# EAGLE design Arduino-DUE-SODIMM (EAGLE 6.4)
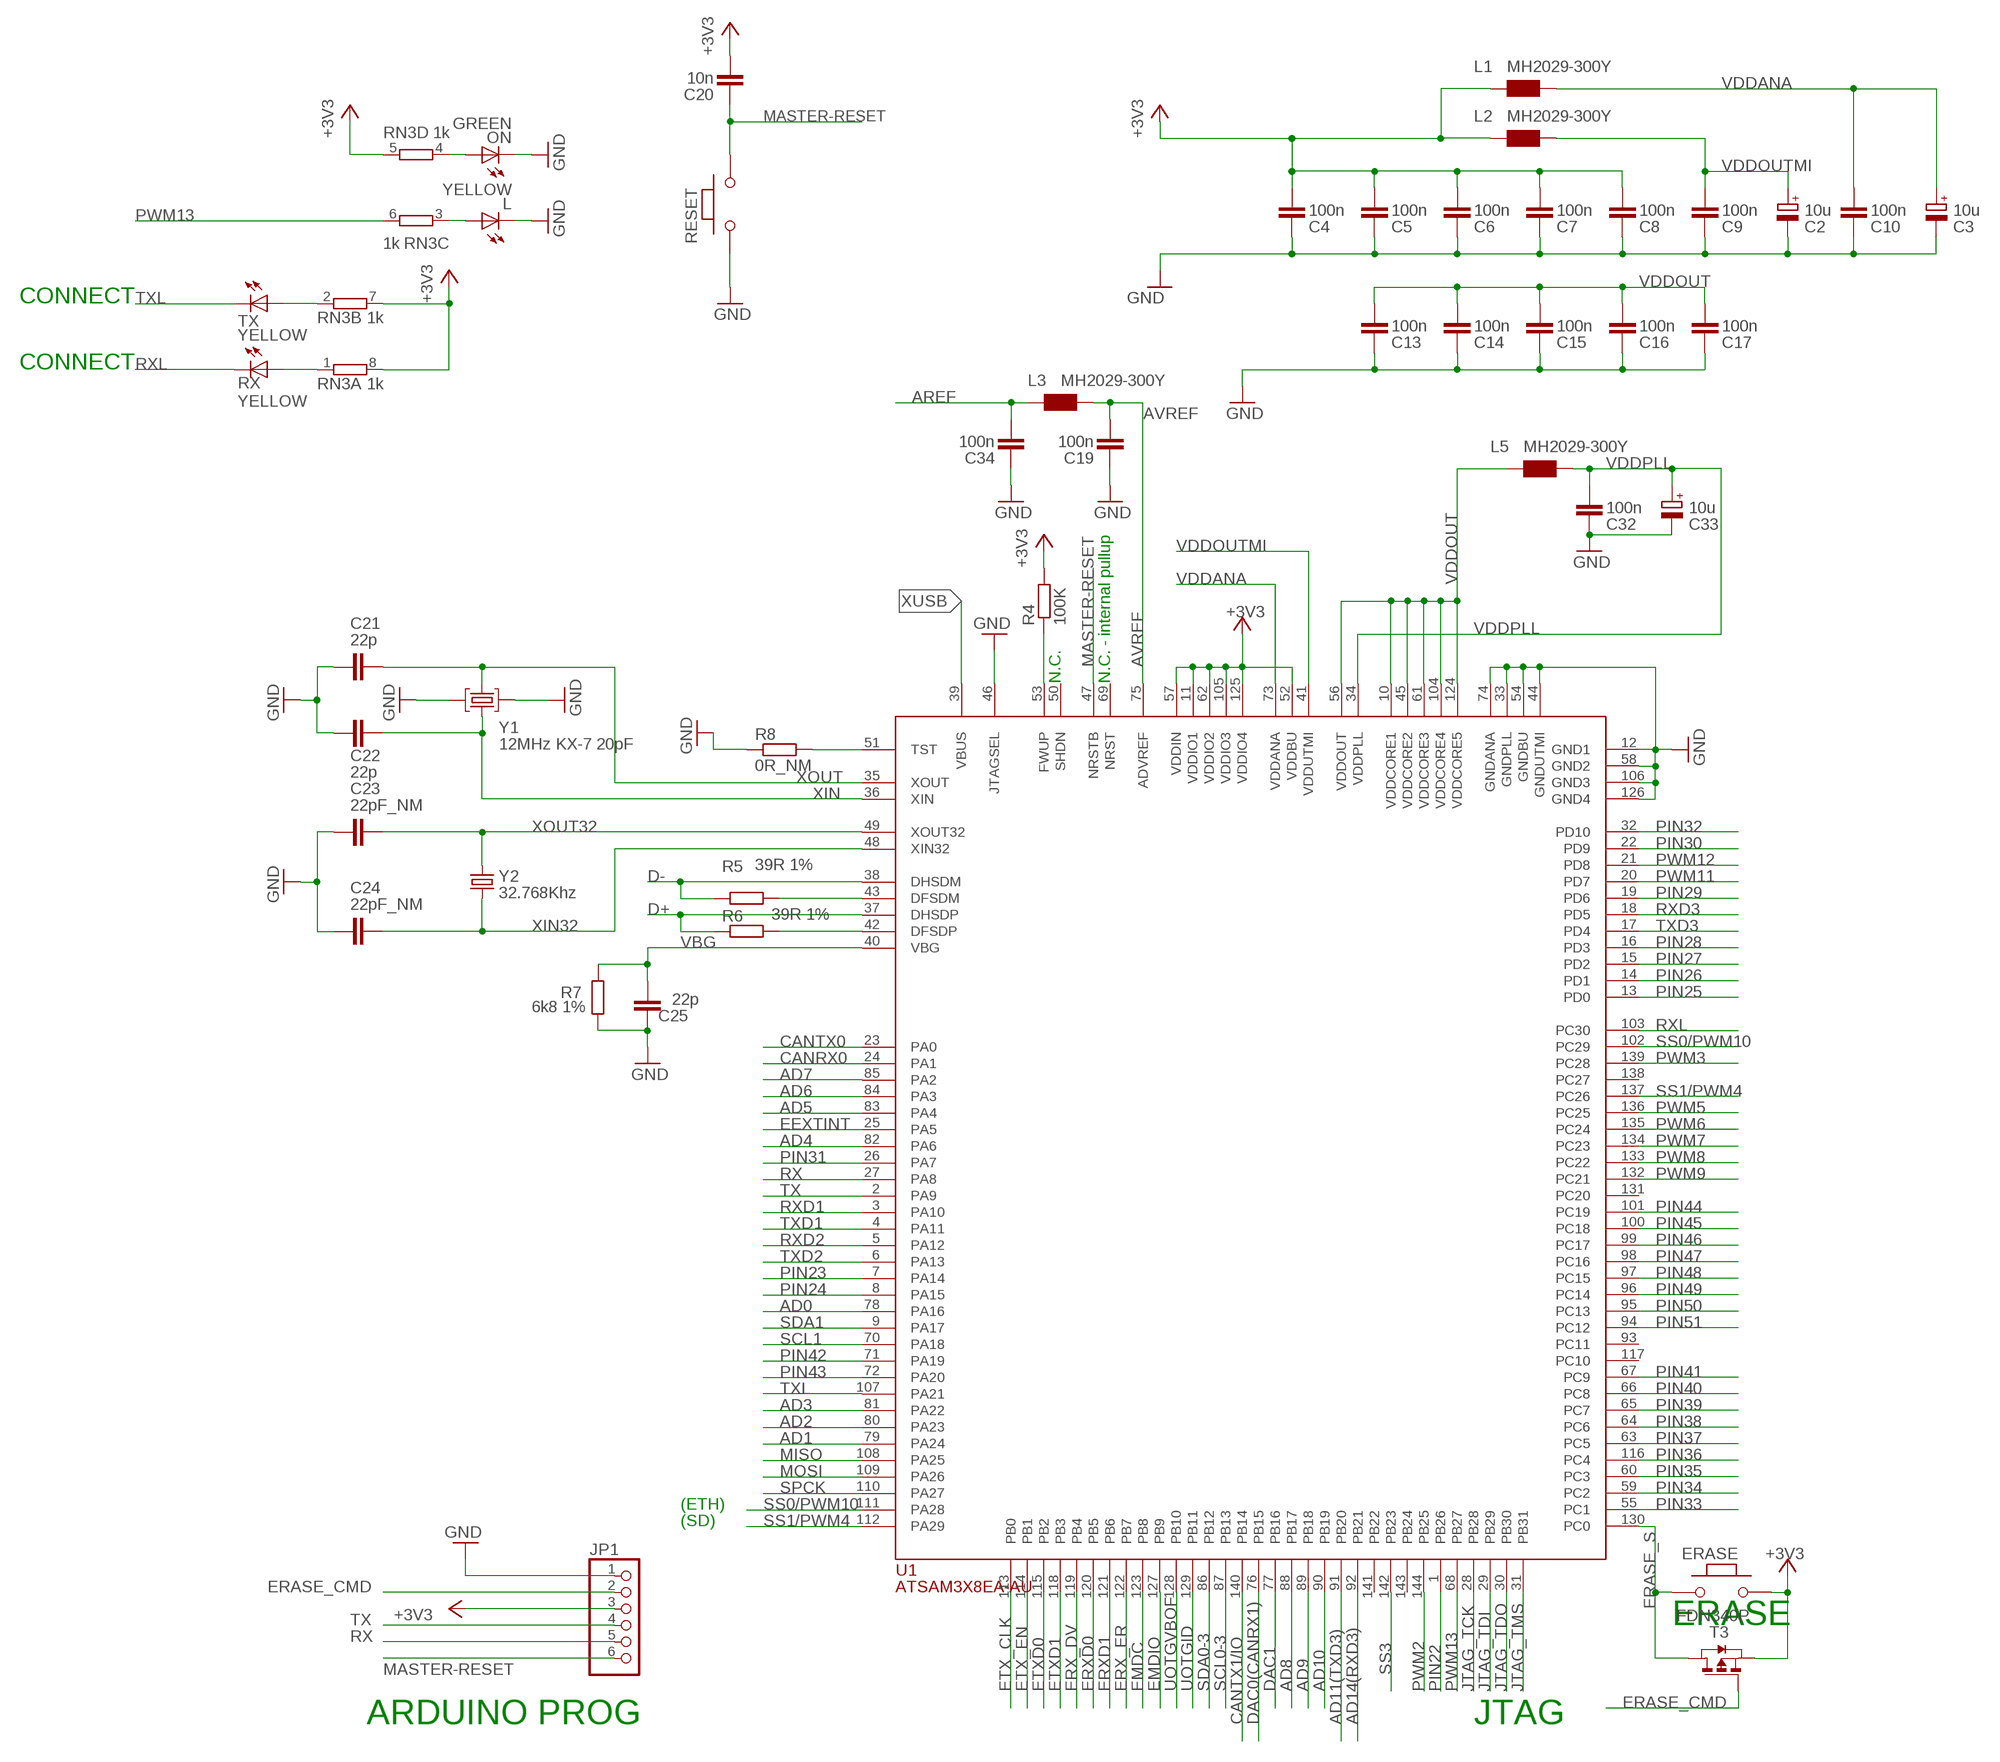
[diagram p0: schematic, sheet 1, part 1 of 2]
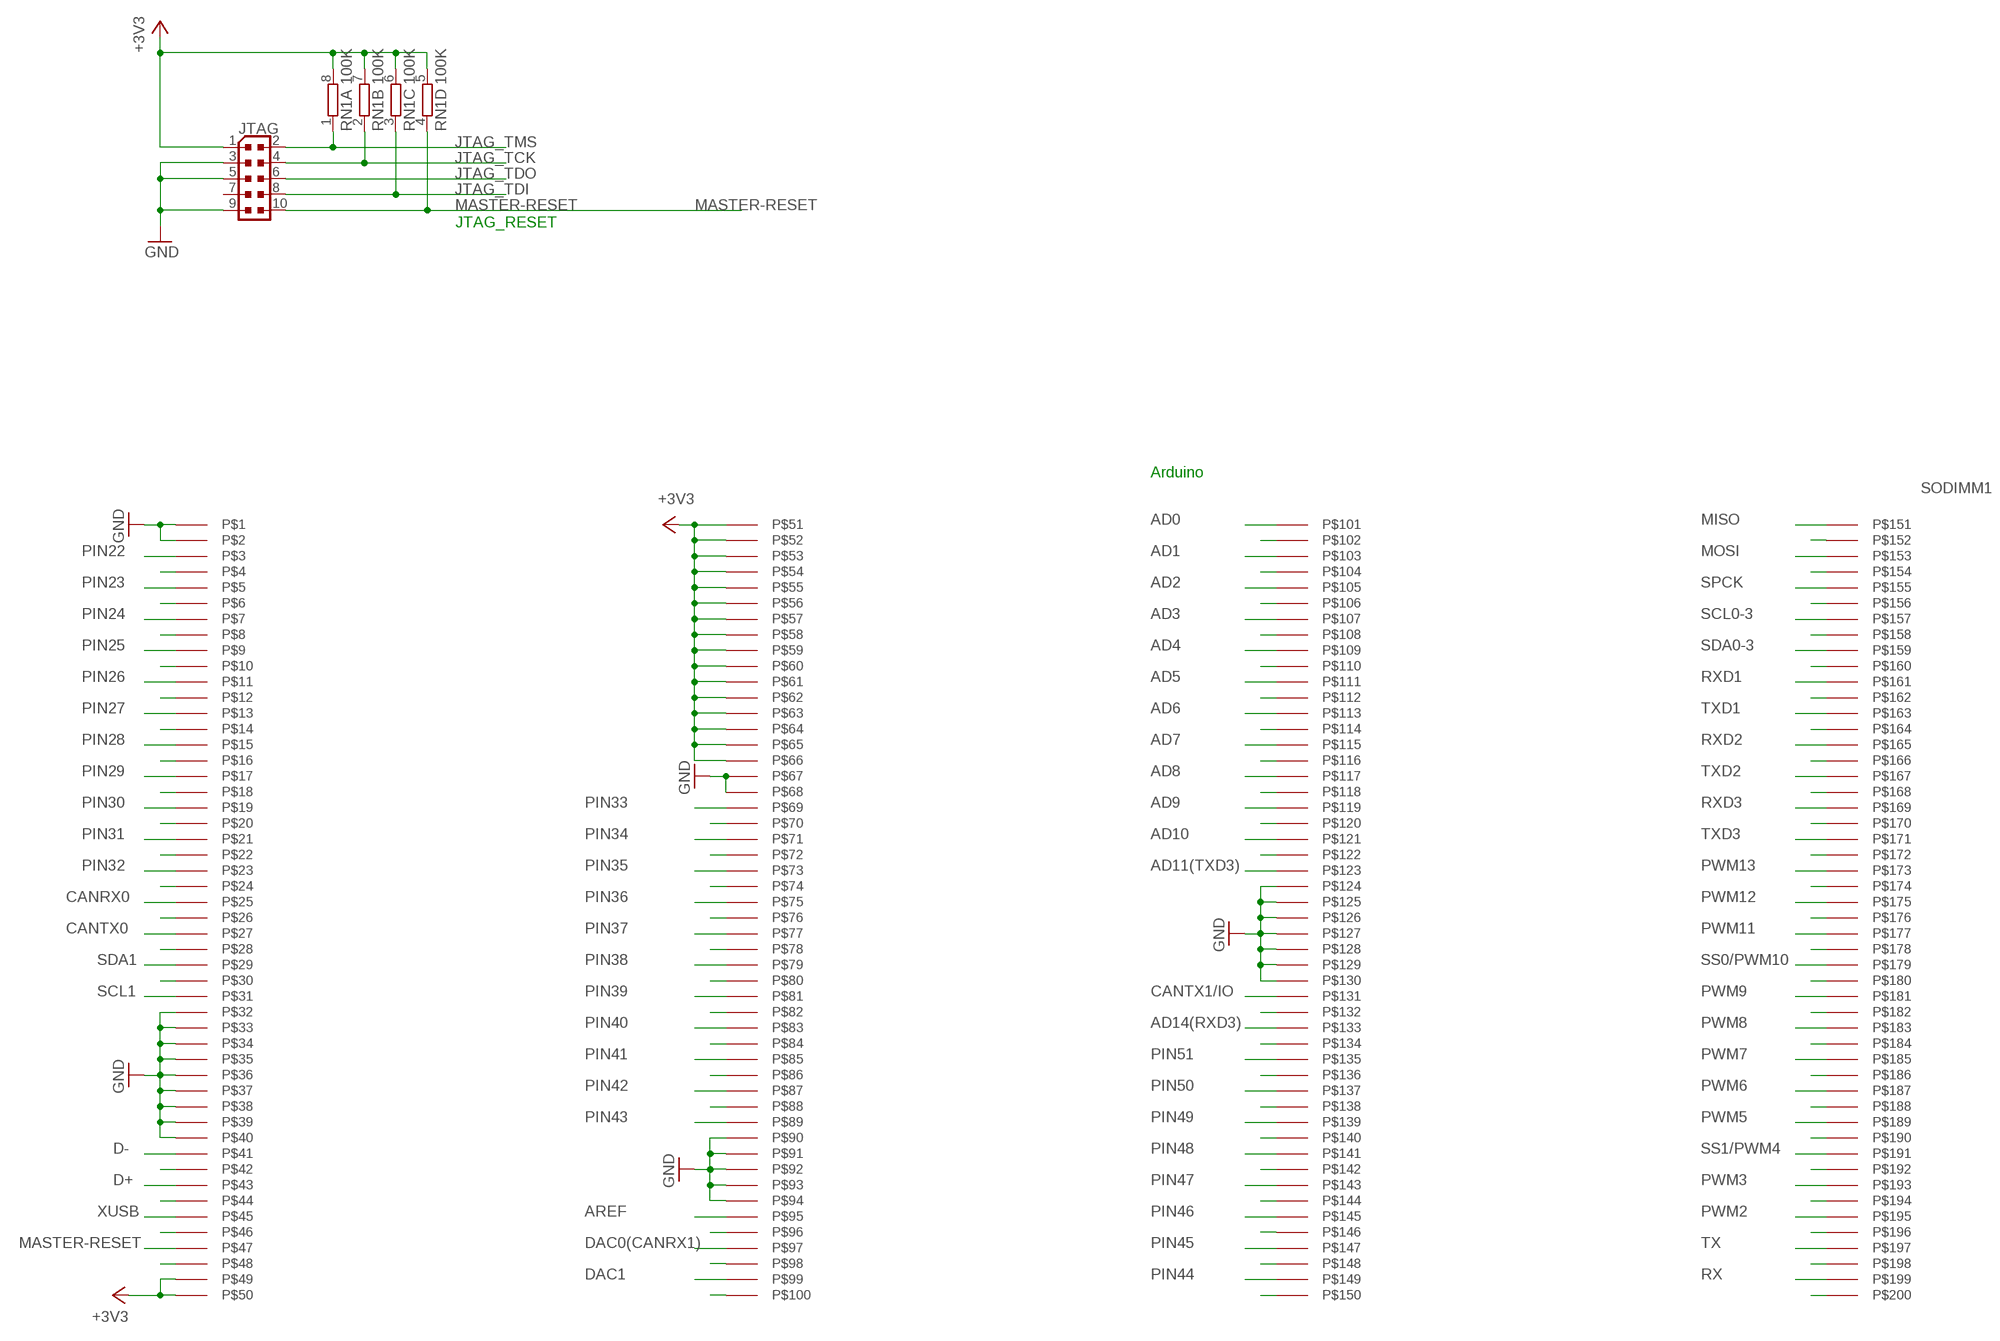
[diagram p1: schematic, sheet 1, part 2 of 2]

## Parts
C2  10u  CPOL-EUSMCB  [SMC_B]
C3  10u  CPOL-EUSMCB  [SMC_B]
C4  100n  C-EUC0402  [C0402]
C5  100n  C-EUC0402  [C0402]
C6  100n  C-EUC0402  [C0402]
C7  100n  C-EUC0402  [C0402]
C8  100n  C-EUC0402  [C0402]
C9  100n  C-EUC0402  [C0402]
C10  100n  C-EUC0402  [C0402]
C13  100n  C-EUC0402  [C0402]
C14  100n  C-EUC0402  [C0402]
C15  100n  C-EUC0402  [C0402]
C16  100n  C-EUC0402  [C0402]
C17  100n  C-EUC0402  [C0402]
C19  100n  C-EUC0402  [C0402]
C20  10n  C-EUC0402  [C0402]
C21  22p  C-EUC0402  [C0402]
C22  22p  C-EUC0402  [C0402]
C23  22pF_NM  C-EUC0402  [C0402]
C24  22pF_NM  C-EUC0402  [C0402]
C25  22p  C-EUC0402  [C0402]
C32  100n  C-EUC0402  [C0402]
C33  10u  CPOL-EUSMCB  [SMC_B]
C34  100n  C-EUC0402  [C0402]
ERASE  MYSMD_PB157  [SMD_157SW]
JP1  PINHD-1X6CB  [1X06-CLEANBIG]
JTAG  PINHEAD_PINHD-2X5PASSO127  [PINHEAD_2X05_127]
L  YELLOW  LEDCHIP-LED0805  [CHIP-LED0805]
L1  MH2029-300Y  WE-CBF_0805  [0805]
L2  MH2029-300Y  WE-CBF_0805  [0805]
L3  MH2029-300Y  WE-CBF_0805  [0805]
L5  MH2029-300Y  WE-CBF_0805  [0805]
ON  GREEN  LEDCHIP-LED0805  [CHIP-LED0805]
R4  100K  R-EU_R0402  [R0402]
R5  39R 1%  R-EU_R0402  [R0402]
R6  39R 1%  R-EU_R0402  [R0402]
R7  6k8 1%  R-EU_R0603  [R0603-ROUND]
R8  0R_NM  R-EU_R0402  [R0402]
RESET  MYSMD_PB157  [SMD_157SW]
RN1  100K  4R-NCAT16  [CAT16]
RN3  1k  4R-NCAY16  [CAY16]
RX  YELLOW  LEDCHIP-LED0805  [CHIP-LED0805]
SODIMM1  SODIMM_BOARDLARGE  [SODIMM-BOARD-67.6X50]
T3  FDN340P  PMOSSOT23  [SOT-23]
TX  YELLOW  LEDCHIP-LED0805  [CHIP-LED0805]
U1  ATSAM3X8EA-AU  ATSAM3X/AAU  [LQFP144]
Y1  12MHz KX-7 20pF  CRYSTAL-3.2-2.5  [CRYSTAL-3.2-2.5]
Y2  32.768Khz  RESONATOR_EPSON_FC_145  [RESONATOR_EPSON_FC_145]

## Nets
+3V3: C4.2 C5.2 C6.2 C7.2 C8.2 C20.2 ERASE.1 JP1.3 JTAG.1 L1.1 L2.1 R4.2 RN1.5 RN1.6 RN1.7 RN1.8 RN3.5 RN3.7 RN3.8 SODIMM1.49 SODIMM1.50 SODIMM1.51 SODIMM1.52 SODIMM1.53 SODIMM1.54 SODIMM1.55 SODIMM1.56 SODIMM1.57 SODIMM1.58 SODIMM1.59 SODIMM1.60 SODIMM1.61 SODIMM1.62 SODIMM1.63 SODIMM1.64 SODIMM1.65 SODIMM1.66 T3.2(S) U1.11(VDDIO1) U1.52(VDDBU) U1.57(VDDIN) U1.62(VDDIO2) U1.105(VDDIO3) U1.125(VDDIO4)
AD0: SODIMM1.101 U1.78(PA16)
AD1: SODIMM1.103 U1.79(PA24)
AD2: SODIMM1.105 U1.80(PA23)
AD3: SODIMM1.107 U1.81(PA22)
AD4: SODIMM1.109 U1.82(PA6)
AD5: SODIMM1.111 U1.83(PA4)
AD6: SODIMM1.113 U1.84(PA3)
AD7: SODIMM1.115 U1.85(PA2)
AD8: SODIMM1.117 U1.88(PB17)
AD9: SODIMM1.119 U1.89(PB18)
AD10: SODIMM1.121 U1.90(PB19)
AD11(TXD3): SODIMM1.123 U1.91(PB20)
AD14(RXD3): SODIMM1.133 U1.92(PB21)
AREF: C34.2 L3.1 SODIMM1.95
AVREF: C19.2 L3.2 U1.75(ADVREF)
CANRX0: SODIMM1.25 U1.24(PA1)
CANTX0: SODIMM1.27 U1.23(PA0)
CANTX1/IO: SODIMM1.131 U1.140(PB14)
D+: R6.1 SODIMM1.43 U1.37(DHSDP)
D-: R5.1 SODIMM1.41 U1.38(DHSDM)
DAC0(CANRX1): SODIMM1.97 U1.76(PB15)
DAC1: SODIMM1.99 U1.77(PB16)
EEXTINT: U1.25(PA5)
EMDC: U1.123(PB8)
EMDIO: U1.127(PB9)
ERASE_CMD: JP1.2 T3.3(G)
ERASE_S: ERASE.2 T3.1(D) U1.130(PC0)
ERX_DV: U1.119(PB4)
ERX_ER: U1.122(PB7)
ERXD0: U1.120(PB5)
ERXD1: U1.121(PB6)
ETX_CLK: U1.113(PB0)
ETX_EN: U1.114(PB1)
ETXD0: U1.115(PB2)
ETXD1: U1.118(PB3)
GND: C2.- C3.- C4.1 C5.1 C6.1 C7.1 C8.1 C9.1 C10.1 C13.1 C14.1 C15.1 C16.1 C17.1 C19.1 C21.2 C22.2 C23.2 C24.2 C25.2 C32.1 C33.- C34.1 JP1.1 JTAG.3 JTAG.5 JTAG.9 L.C ON.C R7.1 R8.1 RESET.2 SODIMM1.1 SODIMM1.2 SODIMM1.4 SODIMM1.6 SODIMM1.8 SODIMM1.10 SODIMM1.12 SODIMM1.14 SODIMM1.16 SODIMM1.18 SODIMM1.20 SODIMM1.22 SODIMM1.24 SODIMM1.26 SODIMM1.28 SODIMM1.30 SODIMM1.32 SODIMM1.33 SODIMM1.34 SODIMM1.35 SODIMM1.36 SODIMM1.37 SODIMM1.38 SODIMM1.39 SODIMM1.40 SODIMM1.42 SODIMM1.44 SODIMM1.46 SODIMM1.48 SODIMM1.67 SODIMM1.68 SODIMM1.70 SODIMM1.72 SODIMM1.74 SODIMM1.76 SODIMM1.78 SODIMM1.80 SODIMM1.82 SODIMM1.84 SODIMM1.86 SODIMM1.88 SODIMM1.90 SODIMM1.91 SODIMM1.92 SODIMM1.93 SODIMM1.94 SODIMM1.96 SODIMM1.98 SODIMM1.100 SODIMM1.102 SODIMM1.106 SODIMM1.108 SODIMM1.110 SODIMM1.112 SODIMM1.114 SODIMM1.116 SODIMM1.118 SODIMM1.120 SODIMM1.122 SODIMM1.124 SODIMM1.125 SODIMM1.126 SODIMM1.127 SODIMM1.128 SODIMM1.129 SODIMM1.130 SODIMM1.132 SODIMM1.134 SODIMM1.136 SODIMM1.138 SODIMM1.140 SODIMM1.142 SODIMM1.144 SODIMM1.146 SODIMM1.148 SODIMM1.150 SODIMM1.152 SODIMM1.154 SODIMM1.156 SODIMM1.158 SODIMM1.160 SODIMM1.162 SODIMM1.164 SODIMM1.166 SODIMM1.168 SODIMM1.170 SODIMM1.172 SODIMM1.174 SODIMM1.176 SODIMM1.178 SODIMM1.180 SODIMM1.182 SODIMM1.184 SODIMM1.186 SODIMM1.188 SODIMM1.190 SODIMM1.192 SODIMM1.194 SODIMM1.196 SODIMM1.198 SODIMM1.200 U1.12(GND1) U1.33(GNDPLL) U1.44(GNDUTMI) U1.46(JTAGSEL) U1.54(GNDBU) U1.58(GND2) U1.74(GNDANA) U1.106(GND3) U1.126(GND4) Y1.2(GND) Y1.4(GND)
JTAG_TCK: JTAG.4 RN1.2 U1.28(PB28)
JTAG_TDI: JTAG.8 RN1.3 U1.29(PB29)
JTAG_TDO: JTAG.6 U1.30(PB30)
JTAG_TMS: JTAG.2 RN1.1 U1.31(PB31)
MASTER-RESET: C20.1 JP1.6 JTAG.10 RESET.1 RN1.4 SODIMM1.47 U1.47(NRSTB)
MISO: SODIMM1.151 U1.108(PA25)
MOSI: SODIMM1.153 U1.109(PA26)
N$1: SODIMM1.104
N$2: L.A RN3.3
N$3: ON.A RN3.4
N$5: R8.2 U1.51(TST)
N$7: R4.1 U1.53(FWUP)
N$11: R5.2 U1.43(DFSDM)
N$12: R6.2 U1.42(DFSDP)
N$54: RN3.1 RX.A
N$55: RN3.2 TX.A
PIN22: SODIMM1.3 U1.1(PB26)
PIN23: SODIMM1.5 U1.7(PA14)
PIN24: SODIMM1.7 U1.8(PA15)
PIN25: SODIMM1.9 U1.13(PD0)
PIN26: SODIMM1.11 U1.14(PD1)
PIN27: SODIMM1.13 U1.15(PD2)
PIN28: SODIMM1.15 U1.16(PD3)
PIN29: SODIMM1.17 U1.19(PD6)
PIN30: SODIMM1.19 U1.22(PD9)
PIN31: SODIMM1.21 U1.26(PA7)
PIN32: SODIMM1.23 U1.32(PD10)
PIN33: SODIMM1.69 U1.55(PC1)
PIN34: SODIMM1.71 U1.59(PC2)
PIN35: SODIMM1.73 U1.60(PC3)
PIN36: SODIMM1.75 U1.116(PC4)
PIN37: SODIMM1.77 U1.63(PC5)
PIN38: SODIMM1.79 U1.64(PC6)
PIN39: SODIMM1.81 U1.65(PC7)
PIN40: SODIMM1.83 U1.66(PC8)
PIN41: SODIMM1.85 U1.67(PC9)
PIN42: SODIMM1.87 U1.71(PA19)
PIN43: SODIMM1.89 U1.72(PA20)
PIN44: SODIMM1.149 U1.101(PC19)
PIN45: SODIMM1.147 U1.100(PC18)
PIN46: SODIMM1.145 U1.99(PC17)
PIN47: SODIMM1.143 U1.98(PC16)
PIN48: SODIMM1.141 U1.97(PC15)
PIN49: SODIMM1.139 U1.96(PC14)
PIN50: SODIMM1.137 U1.95(PC13)
PIN51: SODIMM1.135 U1.94(PC12)
PWM2: SODIMM1.195 U1.144(PB25)
PWM3: SODIMM1.193 U1.139(PC28)
PWM5: SODIMM1.189 U1.136(PC25)
PWM6: SODIMM1.187 U1.135(PC24)
PWM7: SODIMM1.185 U1.134(PC23)
PWM8: SODIMM1.183 U1.133(PC22)
PWM9: SODIMM1.181 U1.132(PC21)
PWM11: SODIMM1.177 U1.20(PD7)
PWM12: SODIMM1.175 U1.21(PD8)
PWM13: RN3.6 SODIMM1.173 U1.68(PB27)
RX: JP1.5 SODIMM1.199 U1.27(PA8)
RXD1: SODIMM1.161 U1.3(PA10)
RXD2: SODIMM1.165 U1.5(PA12)
RXD3: SODIMM1.169 U1.18(PD5)
RXL: RX.C U1.103(PC30)
SCL0-3: SODIMM1.157 U1.87(PB13)
SCL1: SODIMM1.31 U1.70(PA18)
SDA0-3: SODIMM1.159 U1.86(PB12)
SDA1: SODIMM1.29 U1.9(PA17)
SPCK: SODIMM1.155 U1.110(PA27)
SS0/PWM10: SODIMM1.179 U1.102(PC29) U1.111(PA28)
SS1/PWM4: SODIMM1.191 U1.112(PA29) U1.137(PC26)
SS3: U1.142(PB23)
TX: JP1.4 SODIMM1.197 U1.2(PA9)
TXD1: SODIMM1.163 U1.4(PA11)
TXD2: SODIMM1.167 U1.6(PA13)
TXD3: SODIMM1.171 U1.17(PD4)
TXL: TX.C U1.107(PA21)
UOTGID: U1.129(PB11)
UOTGVBOF: U1.128(PB10)
VBG: C25.1 R7.2 U1.40(VBG)
VDDANA: C3.+ C10.2 L1.2 U1.73(VDDANA)
VDDOUT: C13.2 C14.2 C15.2 C16.2 C17.2 L5.1 U1.10(VDDCORE1) U1.45(VDDCORE2) U1.56(VDDOUT) U1.61(VDDCORE3) U1.104(VDDCORE4) U1.124(VDDCORE5)
VDDOUTMI: C2.+ C9.2 L2.2 U1.41(VDDUTMI)
VDDPLL: C32.2 C33.+ L5.2 U1.34(VDDPLL)
XIN: C22.1 U1.36(XIN) Y1.1(C1)
XIN32: C24.1 U1.48(XIN32) Y2.P$2
XOUT: C21.1 U1.35(XOUT) Y1.3(C2)
XOUT32: C23.1 U1.49(XOUT32) Y2.P$1
XUSB: SODIMM1.45 U1.39(VBUS)
Unconnected: JTAG.7 U1.50(SHDN) U1.69(NRST) U1.93(PC11) U1.117(PC10) U1.131(PC20) U1.138(PC27) U1.141(PB22) U1.143(PB24)

## Notes on the sheet
- CONNECT
- CONNECT
- JTAG_RESET
- N.C. | N.C. - internal pullup | Arduino
- (ETH)
- (SD)
- ERASE
- ARDUINO PROG | JTAG

## Library data of the parts
C2 C3 C33 = rcl:CPOL-EU: POLARIZED CAPACITOR, European symbol
C4-C10 C13-C17 C19-C25 C32 C34 = SmartPrj:C-EU: CAPACITOR, European symbol
ERASE RESET = SmartPrj:MYSMD_PB157
JP1 = adafruit:PINHD-1X6: PIN HEADER
JTAG = Arduino_Wifi_shield_v018_tG:PINHEAD_PINHD-2X5: PIN HEADER
L ON RX TX = led:LED: LED OSRAM: - CHIPLED LG R971, LG N971, LY N971, LG Q971, LY Q971, LO R971, LY R971 LH N974, LH R974 LS Q976, LO Q976, LY Q976 LO Q996 - Hyper CHIPLED LW Q18S LB Q993, LB Q99A, LB R99A - SideLED LS A670, LO A670, LY A670, LG A670, LP A670 LB A673, LV A673, LT A673, LW A673 LH A674 LY A675 LS A676, LA A676, LO A676, LY A676, LW A676 LS A679, LY A679, LG A679 - Hyper Micro SIDELED® LS Y876, LA Y876, LO Y876, LY Y876 LT Y87S - SmartLED LW L88C, LW L88S LB L89C, LB L89S, LG L890 LS L89K, LO L89K, LY L89K LS L896, LA L896, LO L896, LY L896 - TOPLED LS T670, LO T670, LY T670, LG T670, LP T670 LSG T670, LSP T670, LSY T670, LOP T670, LYG T670 LG T671, LOG T671, LSG T671 LB T673, LV T673, LT T673, LW T673 LH T674 LS T676, LA T676, LO T676, LY T676, LB T676, LH T676, LSB T676, LW T676 LB T67C, LV T67C, LT T67C, LS T67K, LO T67K, LY T67K, LW E67C LS E67B, LA E67B, LO E67B, LY E67B, LB E67C, LV E67C, LT E67C LW T67C LS T679, LY T679, LG T679 LS T770, LO T770, LY T770, LG T770, LP T770 LB T773, LV T773, LT T773, LW T773 LH T774 LS E675, LA E675, LY E675, LS T675 LS T776, LA T776, LO T776, LY T776, LB T776 LHGB T686 LT T68C, LB T68C - Hyper Mini TOPLED® LB M676 - Mini TOPLED Santana® LG M470 LS M47K, LO M47K, LY M47K Source: http://www.osram.convergy.de LUXEON: - LUMILED® LXK2-PW12-R00, LXK2-PW12-S00, LXK2-PW14-U00, LXK2-PW14-V00 LXK2-PM12-R00, LXK2-PM12-S00, LXK2-PM14-U00 LXK2-PE12-Q00, LXK2-PE12-R00, LXK2-PE12-S00, LXK2-PE14-T00, LXK2-PE14-U00 LXK2-PB12-K00, LXK2-PB12-L00, LXK2-PB12-M00, LXK2-PB14-N00, LXK2-PB14-P00, LXK2-PB14-Q00 LXK2-PR12-L00, LXK2-PR12-M00, LXK2-PR14-Q00, LXK2-PR14-R00 LXK2-PD12-Q00, LXK2-PD12-R00, LXK2-PD12-S00 LXK2-PH12-R00, LXK2-PH12-S00 LXK2-PL12-P00, LXK2-PL12-Q00, LXK2-PL12-R00 Source: www.luxeon.com KINGBRIGHT: KA-3528ASYC Source: www.kingbright.com
L1-L3 L5 = wuerth-elektronik:WE-CBF: SMD EMI Suppression Ferrite Beads - excellent anti-EMI properties - low DCR - impedances till 3000 ohms - rated current up to 6 A
R4-R8 = SmartPrj:R-EU_: RESISTOR, European symbol
RN1 RN3 = resistor-dil:4R-N: Array Chip Resistor Source: RS Component / Phycomp
SODIMM1 = BaseApp2:SODIMM_BOARD: SODIMM BOARD Thickness of board must be 1mm.
T3 = zetex:PMOSSOT23: MOS FET
U1 = SmartPrj:ATSAM3X/A
Y1 = SmartPrj:CRYSTAL-3.2-2.5
Y2 = Arduino_Wifi_shield_v018_tG:RESONATOR_EPSON_FC_145

## Net classes
0 default: width 0.203 mm, drill 0.203 mm, clearance 0.152 mm
1 USB: drill 0.203 mm, clearance 0.203 mm to class 0, clearance 0.152 mm
3 usbvcc: width 0.61 mm, drill 0.508 mm, clearance 0.203 mm to class 0, clearance 0.254 mm

## Board
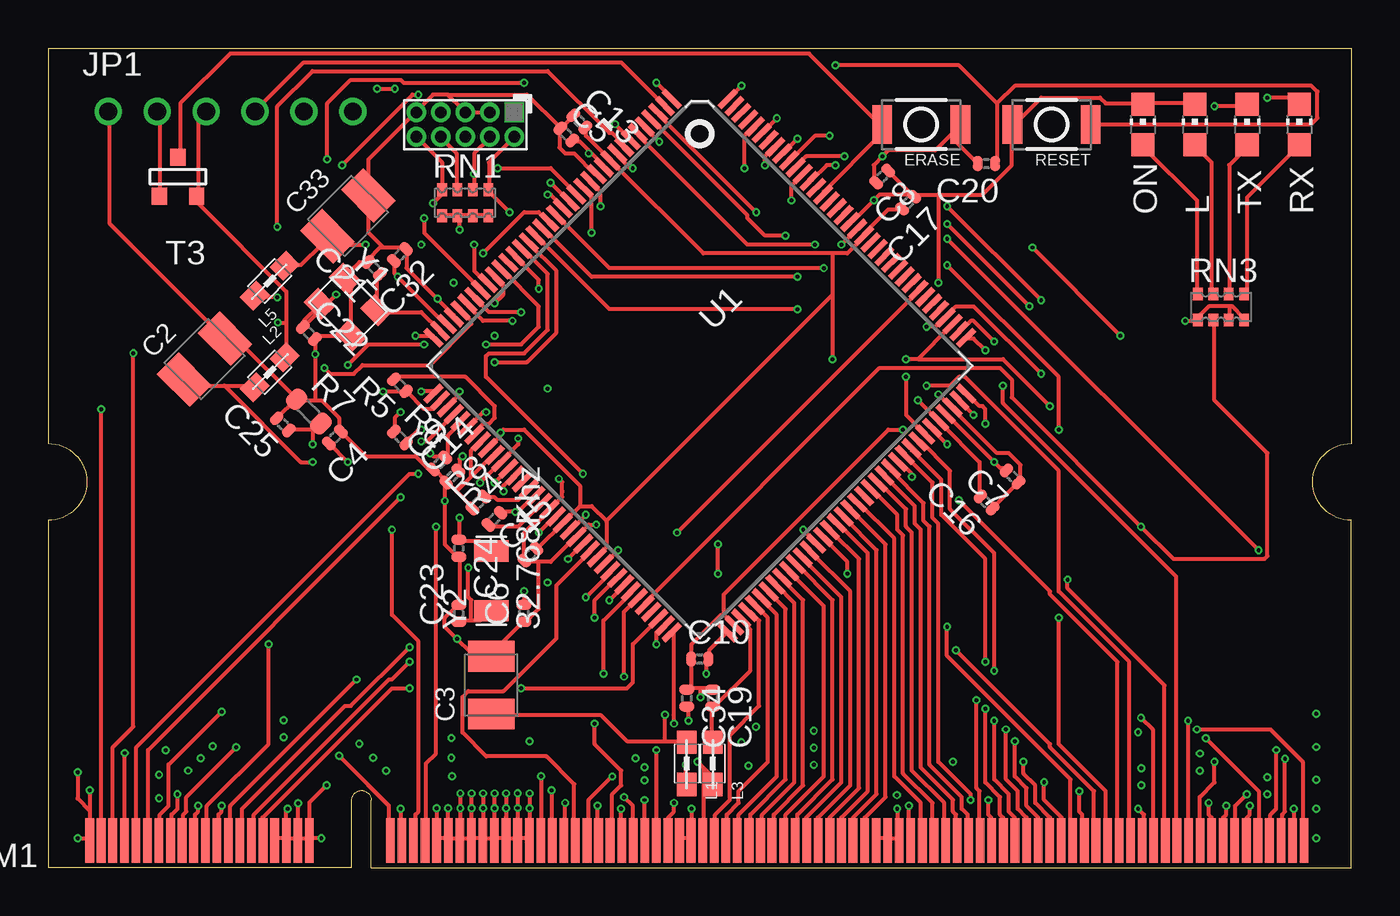
[diagram p2: board, top side]
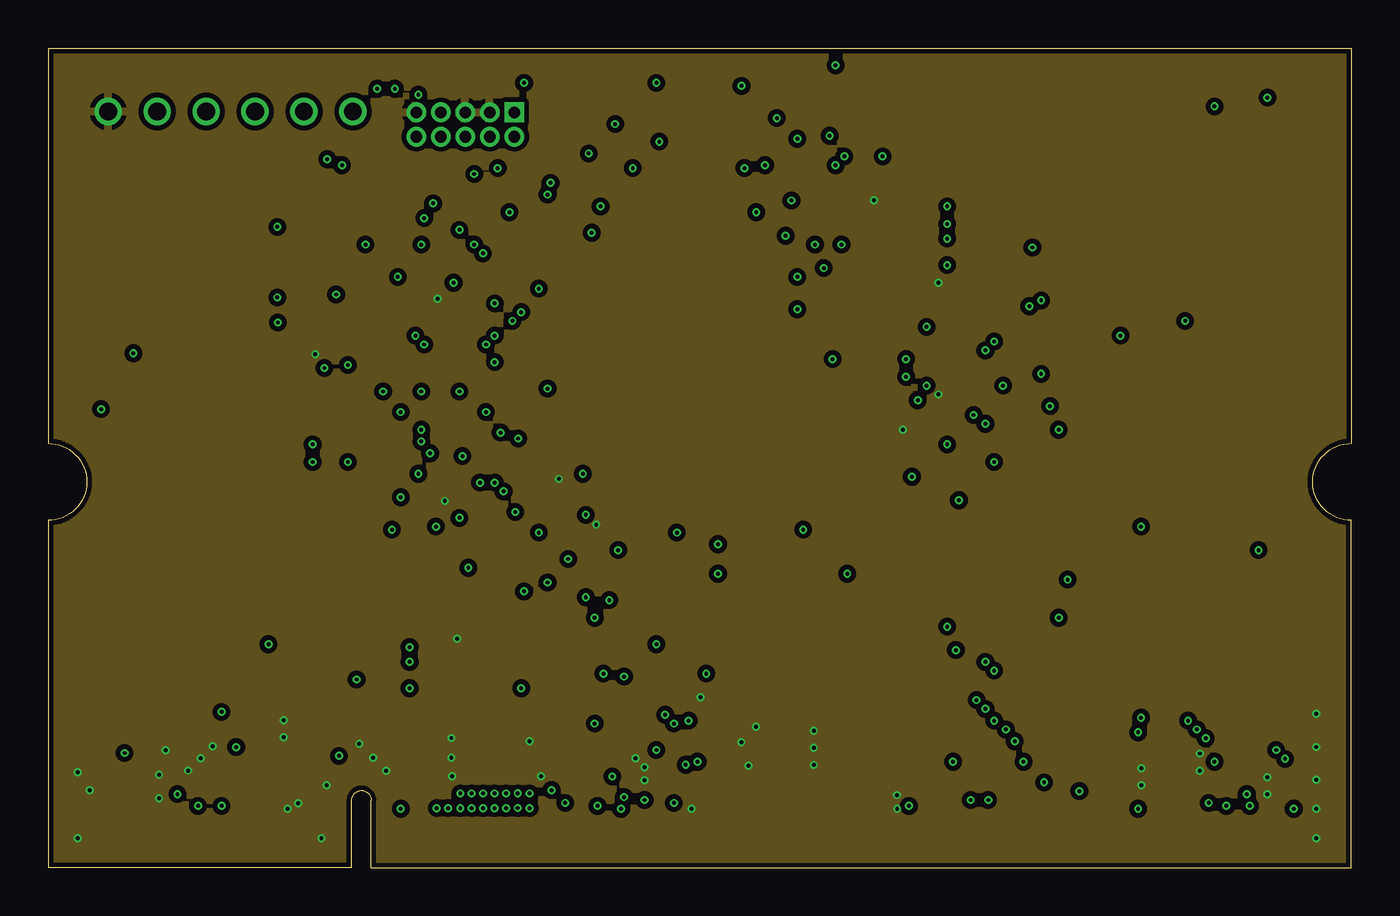
[diagram p3: board, inner layer Route2]
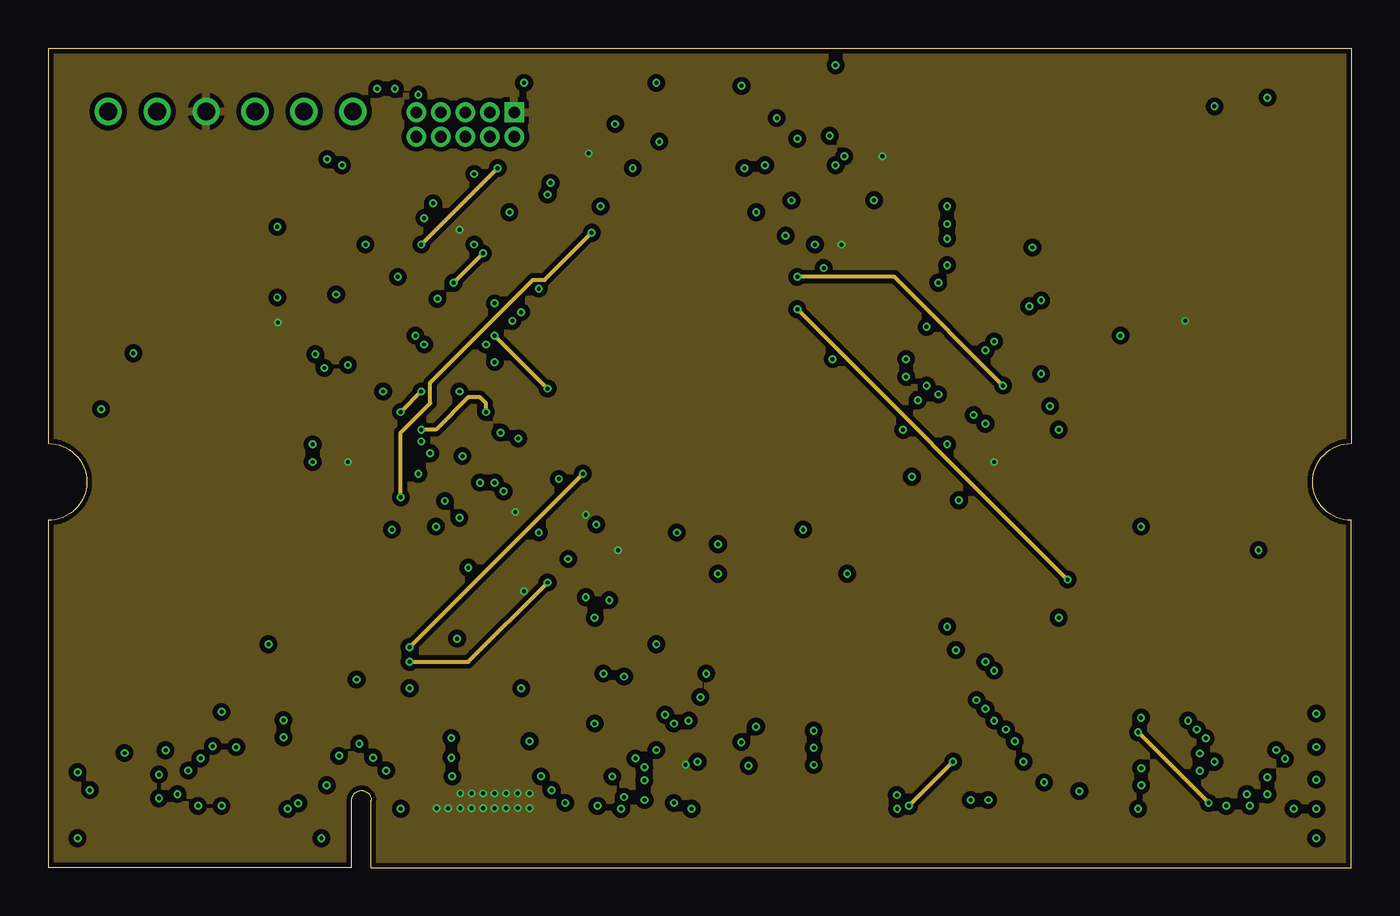
[diagram p4: board, inner layer Route15]
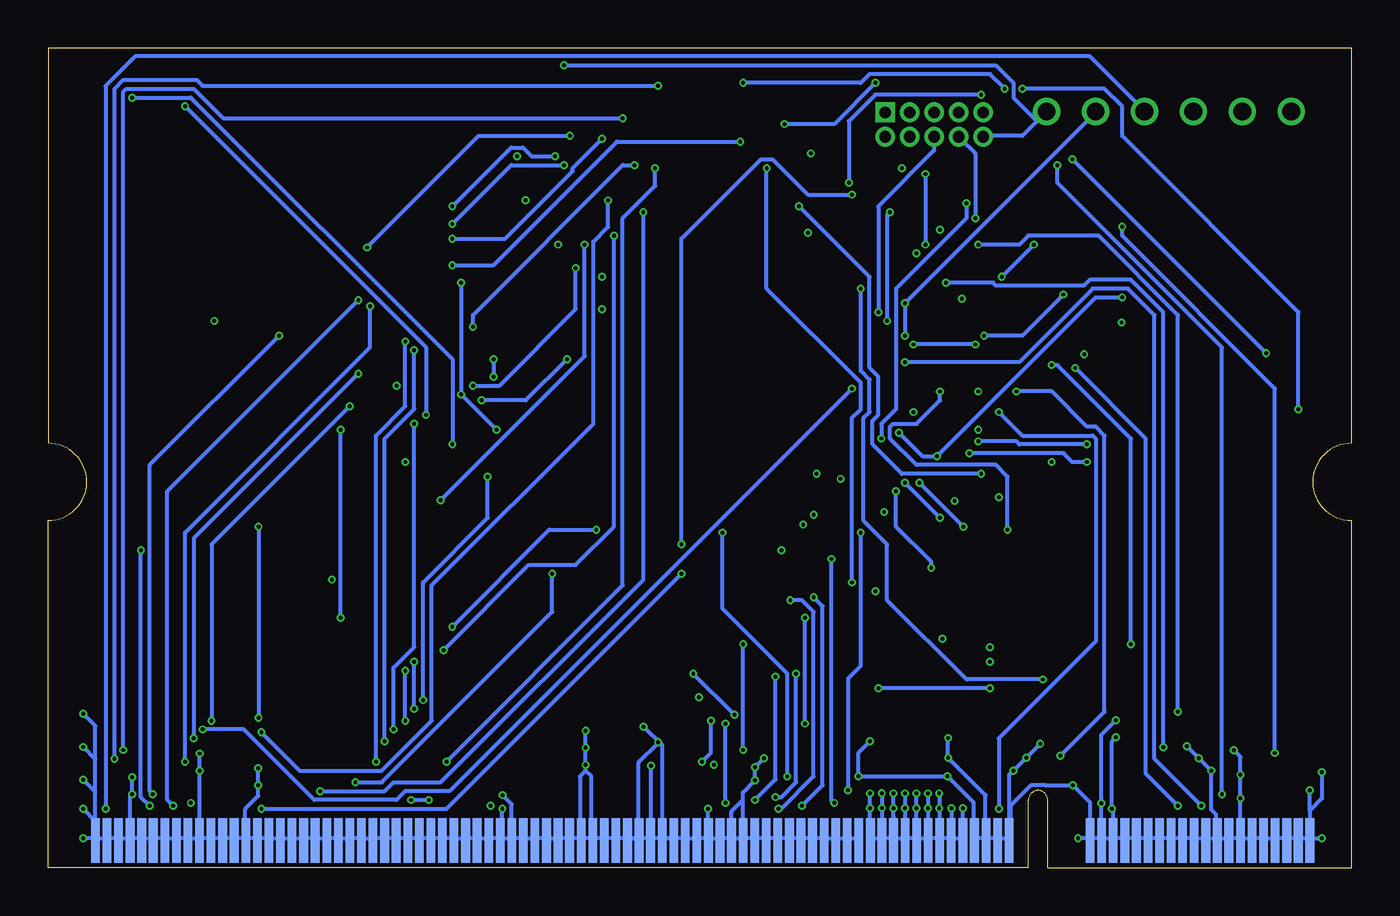
[diagram p5: board, bottom side, seen from below]

Size 67.6 x 42.49 mm. Coordinates in mm from the lower left corner, seen from the top.
Copper layers (1*2*15*16): Top 0.035mm / dielectric 0.2mm / Route2 0.035mm / dielectric 1mm / Route15 0.035mm / dielectric 0.2mm / Bottom 0.035mm
Design rules "6666666666 *": minimum track width 6mil, minimum drill 8mil, track to track 6mil, track to pad 6mil, pad to pad 6mil, via to via 6mil, smd to smd 6mil, copper to edge 4mil, drill to drill 8mil, minimum pad ring 8mil, minimum via ring 4mil, stop-mask expansion 4mil, vias tented up to drill 0mil, thermal gap 10mil

### Footprints (pad centres in the part's own frame; a part is rotated, then mirrored left to right if it is on the bottom)
SMC_B = smd 1.6 x 2.4: + -1.5,0; - 1.5,0
C0402 = smd 0.508 x 0.762: 1 -0.445,0; 2 0.445,0
SMD_157SW = smd 1.016 x 1.981: 1 -2.032,0; 2 2.032,0
1X06-CLEANBIG = drill 0.914 pad 1.422: 1 -6.35,0; 2 -3.81,0; 3 -1.27,0; 4 1.27,0; 5 3.81,0; 6 6.35,0
PINHEAD_2X05_127 = drill 0.6 pad 1.016 square: 1 -0.635,2.54 | drill 0.6 pad 1.016: 2 0.635,2.54; 3 -0.635,1.27; 4 0.635,1.27; 5 -0.635,0; 6 0.635,0; 7 -0.635,-1.27; 8 0.635,-1.27; 9 -0.635,-2.54; 10 0.635,-2.54
CHIP-LED0805 = smd 1.2 x 1.2: A 0,-1.05; C 0,1.05
0805 = smd 1.2 x 1: 1 -1.1,0; 2 1.1,0
R0402 = smd 0.508 x 0.762: 1 -0.445,0; 2 0.445,0
R0603-ROUND = smd 0.898 x 1.1: 1 -0.889,0; 2 0.889,0
CAT16 = smd 0.5 x 0.65: 1 -1.2,-0.675; 2 -0.4,-0.675; 3 0.4,-0.675; 4 1.2,-0.675; 5 1.2,0.675; 6 0.4,0.675; 7 -0.4,0.675; 8 -1.2,0.675
CAY16 = smd 0.5 x 0.65: 1 -1.2,-0.675; 2 -0.4,-0.675; 3 0.4,-0.675; 4 1.2,-0.675; 5 1.2,0.675; 6 0.4,0.675; 7 -0.4,0.675; 8 -1.2,0.675
SODIMM-BOARD-67.6X50 = smd 0.45 x 2.3: 1 2.15,1.4; 3 2.75,1.4; 5 3.35,1.4; 7 3.95,1.4; 9 4.55,1.4; 11 5.15,1.4; 13 5.75,1.4; 15 6.35,1.4; 17 6.95,1.4; 19 7.55,1.4; 21 8.15,1.4; 23 8.75,1.4; 25 9.35,1.4; 27 9.95,1.4; 29 10.55,1.4; 31 11.15,1.4; 33 11.75,1.4; 35 12.35,1.4; 37 12.95,1.4; 39 13.55,1.4; 41 17.75,1.4; 43 18.35,1.4; 45 18.95,1.4; 47 19.55,1.4; 49 20.15,1.4; 51 20.75,1.4; 53 21.35,1.4; 55 21.95,1.4; 57 22.55,1.4; 59 23.15,1.4; 61 23.75,1.4; 63 24.35,1.4; 65 24.95,1.4; 67 25.55,1.4; 69 26.15,1.4; 71 26.75,1.4; 73 27.35,1.4; 75 27.95,1.4; 77 28.55,1.4; 79 29.15,1.4; 81 29.75,1.4; 83 30.35,1.4; 85 30.95,1.4; 87 31.55,1.4; 89 32.15,1.4; 91 32.75,1.4; 93 33.35,1.4; 95 33.95,1.4; 97 34.55,1.4; 99 35.15,1.4; 101 35.75,1.4; 103 36.35,1.4; 105 36.95,1.4; 107 37.55,1.4; 109 38.15,1.4; 111 38.75,1.4; 113 39.35,1.4; 115 39.95,1.4; 117 40.55,1.4; 119 41.15,1.4; 121 41.75,1.4; 123 42.35,1.4; 125 42.95,1.4; 127 43.55,1.4; 129 44.15,1.4; 131 44.75,1.4; 133 45.35,1.4; 135 45.95,1.4; 137 46.55,1.4; 139 47.15,1.4; 141 47.75,1.4; 143 48.35,1.4; 145 48.95,1.4; 147 49.55,1.4; 149 50.15,1.4; 151 50.75,1.4; 153 51.35,1.4; 155 51.95,1.4; 157 52.55,1.4; 159 53.15,1.4; 161 53.75,1.4; 163 54.35,1.4; 165 54.95,1.4; 167 55.55,1.4; 169 56.15,1.4; 171 56.75,1.4; 173 57.35,1.4; 175 57.95,1.4; 177 58.55,1.4; 179 59.15,1.4; 181 59.75,1.4; 183 60.35,1.4; 185 60.95,1.4; 187 61.55,1.4; 189 62.15,1.4; 191 62.75,1.4; 193 63.35,1.4; 195 63.95,1.4; 197 64.55,1.4; 199 65.15,1.4 | smd 0.45 x 2.3 bottom: 2 2.15,1.4; 4 2.75,1.4; 6 3.35,1.4; 8 3.95,1.4; 10 4.55,1.4; 12 5.15,1.4; 14 5.75,1.4; 16 6.35,1.4; 18 6.95,1.4; 20 7.55,1.4; 22 8.15,1.4; 24 8.75,1.4; 26 9.35,1.4; 28 9.95,1.4; 30 10.55,1.4; 32 11.15,1.4; 34 11.75,1.4; 36 12.35,1.4; 38 12.95,1.4; 40 13.55,1.4; 42 17.75,1.4; 44 18.35,1.4; 46 18.95,1.4; 48 19.55,1.4; 50 20.15,1.4; 52 20.75,1.4; 54 21.35,1.4; 56 21.95,1.4; 58 22.55,1.4; 60 23.15,1.4; 62 23.75,1.4; 64 24.35,1.4; 66 24.95,1.4; 68 25.55,1.4; 70 26.15,1.4; 72 26.75,1.4; 74 27.35,1.4; 76 27.95,1.4; 78 28.55,1.4; 80 29.15,1.4; 82 29.75,1.4; 84 30.35,1.4; 86 30.95,1.4; 88 31.55,1.4; 90 32.15,1.4; 92 32.75,1.4; 94 33.35,1.4; 96 33.95,1.4; 98 34.55,1.4; 100 35.15,1.4; 102 35.75,1.4; 104 36.35,1.4; 106 36.95,1.4; 108 37.55,1.4; 110 38.15,1.4; 112 38.75,1.4; 114 39.35,1.4; 116 39.95,1.4; 118 40.55,1.4; 120 41.15,1.4; 122 41.75,1.4; 124 42.35,1.4; 126 42.95,1.4; 128 43.55,1.4; 130 44.15,1.4; 132 44.75,1.4; 134 45.35,1.4; 136 45.95,1.4; 138 46.55,1.4; 140 47.15,1.4; 142 47.75,1.4; 144 48.35,1.4; 146 48.95,1.4; 148 49.55,1.4; 150 50.15,1.4; 152 50.75,1.4; 154 51.35,1.4; 156 51.95,1.4; 158 52.55,1.4; 160 53.15,1.4; 162 53.75,1.4; 164 54.35,1.4; 166 54.95,1.4; 168 55.55,1.4; 170 56.15,1.4; 172 56.75,1.4; 174 57.35,1.4; 176 57.95,1.4; 178 58.55,1.4; 180 59.15,1.4; 182 59.75,1.4; 184 60.35,1.4; 186 60.95,1.4; 188 61.55,1.4; 190 62.15,1.4; 192 62.75,1.4; 194 63.35,1.4; 196 63.95,1.4; 198 64.55,1.4; 200 65.15,1.4
SOT-23 = smd 0.787 x 0.889: 1 0.025,-1.016; 2 -0.94,1.016; 3 0.991,1.016
LQFP144 = smd 0.3 x 1.2: 1 -8.75,-10.8; 2 -8.25,-10.8; 3 -7.75,-10.8; 4 -7.25,-10.8; 5 -6.75,-10.8; 6 -6.25,-10.8; 7 -5.75,-10.8; 8 -5.25,-10.8; 9 -4.75,-10.8; 10 -4.25,-10.8; 11 -3.75,-10.8; 12 -3.25,-10.8; 13 -2.75,-10.8; 14 -2.25,-10.8; 15 -1.75,-10.8; 16 -1.25,-10.8; 17 -0.75,-10.8; 18 -0.25,-10.8; 19 0.25,-10.8; 20 0.75,-10.8; 21 1.25,-10.8; 22 1.75,-10.8; 23 2.25,-10.8; 24 2.75,-10.8; 25 3.25,-10.8; 26 3.75,-10.8; 27 4.25,-10.8; 28 4.75,-10.8; 29 5.25,-10.8; 30 5.75,-10.8; 31 6.25,-10.8; 32 6.75,-10.8; 33 7.25,-10.8; 34 7.75,-10.8; 35 8.25,-10.8; 36 8.75,-10.8; 73 8.75,10.8; 74 8.25,10.8; 75 7.75,10.8; 76 7.25,10.8; 77 6.75,10.8; 78 6.25,10.8; 79 5.75,10.8; 80 5.25,10.8; 81 4.75,10.8; 82 4.25,10.8; 83 3.75,10.8; 84 3.25,10.8; 85 2.75,10.8; 86 2.25,10.8; 87 1.75,10.8; 88 1.25,10.8; 89 0.75,10.8; 90 0.25,10.8; 91 -0.25,10.8; 92 -0.75,10.8; 93 -1.25,10.8; 94 -1.75,10.8; 95 -2.25,10.8; 96 -2.75,10.8; 97 -3.25,10.8; 98 -3.75,10.8; 99 -4.25,10.8; 100 -4.75,10.8; 101 -5.25,10.8; 102 -5.75,10.8; 103 -6.25,10.8; 104 -6.75,10.8; 105 -7.25,10.8; 106 -7.75,10.8; 107 -8.25,10.8; 108 -8.75,10.8 | smd 1.2 x 0.3: 37 10.8,-8.75; 38 10.8,-8.25; 39 10.8,-7.75; 40 10.8,-7.25; 41 10.8,-6.75; 42 10.8,-6.25; 43 10.8,-5.75; 44 10.8,-5.25; 45 10.8,-4.75; 46 10.8,-4.25; 47 10.8,-3.75; 48 10.8,-3.25; 49 10.8,-2.75; 50 10.8,-2.25; 51 10.8,-1.75; 52 10.8,-1.25; 53 10.8,-0.75; 54 10.8,-0.25; 55 10.8,0.25; 56 10.8,0.75; 57 10.8,1.25; 58 10.8,1.75; 59 10.8,2.25; 60 10.8,2.75; 61 10.8,3.25; 62 10.8,3.75; 63 10.8,4.25; 64 10.8,4.75; 65 10.8,5.25; 66 10.8,5.75; 67 10.8,6.25; 68 10.8,6.75; 69 10.8,7.25; 70 10.8,7.75; 71 10.8,8.25; 72 10.8,8.75; 109 -10.8,8.75; 110 -10.8,8.25; 111 -10.8,7.75; 112 -10.8,7.25; 113 -10.8,6.75; 114 -10.8,6.25; 115 -10.8,5.75; 116 -10.8,5.25; 117 -10.8,4.75; 118 -10.8,4.25; 119 -10.8,3.75; 120 -10.8,3.25; 121 -10.8,2.75; 122 -10.8,2.25; 123 -10.8,1.75; 124 -10.8,1.25; 125 -10.8,0.75; 126 -10.8,0.25; 127 -10.8,-0.25; 128 -10.8,-0.75; 129 -10.8,-1.25; 130 -10.8,-1.75; 131 -10.8,-2.25; 132 -10.8,-2.75; 133 -10.8,-3.25; 134 -10.8,-3.75; 135 -10.8,-4.25; 136 -10.8,-4.75; 137 -10.8,-5.25; 138 -10.8,-5.75; 139 -10.8,-6.25; 140 -10.8,-6.75; 141 -10.8,-7.25; 142 -10.8,-7.75; 143 -10.8,-8.25; 144 -10.8,-8.75
CRYSTAL-3.2-2.5 = smd 1.3 x 1.05: 1 -1.15,-0.925; 2 1.15,-0.925; 3 1.15,0.925; 4 -1.15,0.925
RESONATOR_EPSON_FC_145 = smd 1.1 x 1.8: P$1 -1.55,0; P$2 1.55,0

### Placement (x,y rotation side)
C2  8.11,26.36 45 top
C3  22.98,9.46 90 top
C4  14.87,22.31 225 top
C5  26.87,38.02 315 top
C6  24.67,13.18 90 top
C7  50.02,20.28 135 top
C8  43.26,35.83 225 top
C9  20.28,20.96 45 top
C10  33.8,10.82 0 top
C13  27.55,38.7 315 top
C14  20.96,20.28 45 top
C15  25.01,16.22 45 top
C16  48.67,18.93 135 top
C17  44.62,34.48 225 top
C19  34.48,8.79 270 top
C20  48.67,36.5 180 top
C21  16.9,31.1 135 top
C22  13.52,27.72 315 top
C23  21.29,13.18 90 top
C24  21.29,16.56 270 top
C25  12.17,22.98 135 top
C32  18.25,31.77 225 top
C33  15.55,33.8 45 top
C34  33.12,8.79 270 top
ERASE  45.29,38.53 180 top
JP1  9.46,39.21 0 top
JTAG  21.63,38.53 270 top
L  59.49,38.53 0 top
L1  33.12,5.41 90 top
L2  11.49,25.69 225 top
L3  34.48,5.41 90 top
L5  11.49,30.42 45 top
ON  56.78,38.53 0 top
R4  23.15,18.08 45 top
R5  18.25,25.01 135 top
R6  18.25,22.31 315 top
R7  13.52,23.66 315 top
R8  22.31,18.93 45 top
RESET  52.05,38.53 180 top
RN1  21.63,34.48 180 top
RN3  60.84,29.07 180 top
RX  64.9,38.53 0 top
SODIMM1  0,0 0 top
T3  6.76,35.83 180 top
TX  62.19,38.53 0 top
U1  33.8,26.03 225 top
Y1  15.55,29.07 315 top
Y2  22.98,14.87 90 top

### Tracks (layer width: path | path; a pad name or v marks a point on that pad's centre or on a via)
+3V3  (via drill 0.2)
  Top 0.203: SODIMM1.65 24.84,1.52 24.38,1.52 SODIMM1.63 24.36,1.52 | SODIMM1.50 20.27,1.52 20.73,1.52 SODIMM1.51 20.88,1.52 21.34,1.52 SODIMM1.53 21.49,1.52 21.95,1.52 SODIMM1.55 22.1,1.52 22.4,1.52 SODIMM1.57 22.55,1.52 23.01,1.52 SODIMM1.59 23.16,1.52 23.62,1.52 SODIMM1.61 23.77,1.52 24.36,1.52 | 46.79,37.95 47.24,38.41 ERASE.1 | 46.79,37.95 46.02,37.19 43.59,37.19 v43.28,36.88 42.82,36.42 42.82,35.66 C8.2 | 46.79,37.95 48.16,36.58 C20.2 | C7.2 49.68,20.73 49.38,20.73 v49.07,21.03 46.63,23.47 U1.105 | 28.19,37.03 28.8,36.42 U1.11 | 28.19,37.03 27.58,37.64 27.28,37.64 C5.2 | R4.2 23.47,18.44 v24.23,18.44 24.38,18.44 25.15,19.2 U1.52 | 61.27,29.11 61.42,29.11 62.03,28.5 RN3.8 | 61.27,29.11 60.2,29.11 59.74,28.65 59.74,28.5 RN3.5 59.59,28.35 v58.98,28.35 | 61.27,29.11 61.27,28.5 RN3.7 | RN1.5 20.57,33.83 21.18,33.83 RN1.6 | RN1.8 22.71,33.83 22.1,33.83 RN1.7 21.95,33.83 21.34,33.83 RN1.6 | v24.69,14.33 24.69,13.72 C6.2 | v15.54,21.03 14.63,21.95 C4.2 | JP1.3 8.08,39.17 7.77,38.86 7.77,34.9 T3.2 7.77,34.75 7.77,34.44 12.34,29.87 12.34,26.52 L2.1 | v33.07,5.33 33.07,4.42 L1.1 | v27.89,18.29 27.13,17.53 U1.57 | v29.57,16.46 28.96,15.85 U1.62 | v41.15,32.31 41.91,33.07 U1.125 | v21.34,33.07 21.34,33.68 RN1.6 | v28.04,37.03 28.19,37.03 | v24.36,3.09 24.36,1.52 | v23.74,3.08 23.74,1.86 | 23.15,1.77 v23.15,3.08 | v22.56,3.08 22.56,1.73 | 21.97,1.73 v21.97,3.08 | v21.38,3.08 21.38,1.69 | 20.75,1.6 v20.75,3.08 | v20.15,3.08 20.15,1.48 | v24.97,3.08 24.97,1.73 | v24.36,3.85 24.36,2.28 | v23.74,3.85 23.74,2.62 | 23.15,2.54 v23.15,3.85 | v22.56,3.85 22.56,2.49 | 21.97,2.49 v21.97,3.85 | v21.38,3.85 21.38,2.45 | v24.97,3.85 24.97,2.49
  Top 0.203: v11.91,28.27 12.34,28.27
  Bottom 0.203: SODIMM1.65 24.84,1.52 24.38,1.52 SODIMM1.63 24.36,1.52 | SODIMM1.50 20.27,1.52 20.73,1.52 SODIMM1.51 20.88,1.52 21.34,1.52 SODIMM1.53 21.49,1.52 21.95,1.52 SODIMM1.55 22.1,1.52 22.4,1.52 SODIMM1.57 22.55,1.52 23.01,1.52 SODIMM1.59 23.16,1.52 23.62,1.52 SODIMM1.61 23.77,1.52 24.36,1.52 | v24.36,3.09 24.36,1.52 | 23.74,1.86 v23.74,3.08 | v23.15,3.08 23.15,1.77 | 22.56,1.73 v22.56,3.08 | v21.97,3.08 21.97,1.73 | v21.38,3.08 21.38,1.65 | v20.75,3.08 20.75,1.6 | 20.15,1.48 v20.15,3.08 | 24.97,1.73 v24.97,3.08 | v24.36,3.85 24.36,2.28 | 23.74,2.62 v23.74,3.85 | v23.15,3.85 23.15,2.54 | 22.56,2.49 v22.56,3.85 | v21.97,3.85 21.97,2.49 | v21.38,3.85 21.38,2.41 | 24.97,2.49 v24.97,3.85
  pour Route15 (isolate 0.254): -2.7,45.29 76.05,44.95 76.05,-3.04 -2.7,-2.7
AD0
  Top 0.203: U1.78 37.03,13.87 37.8,13.11 37.8,4.72 35.81,2.74 35.81,1.52 SODIMM1.101
AD1
  Top 0.203: U1.79 37.49,14.17 38.25,13.41 38.25,4.57 36.42,2.74 36.42,1.52 SODIMM1.103
AD2
  Top 0.203: U1.80 37.8,14.63 38.71,13.72 38.71,4.42 37.03,2.74 37.03,1.52 SODIMM1.105
AD3
  Top 0.203: U1.81 38.1,14.94 39.17,13.87 39.17,4.27 37.64,2.74 37.64,1.52 SODIMM1.107
AD4
  Top 0.203: U1.82 38.56,15.24 40.23,13.56 40.23,4.72 38.25,2.74 38.25,1.52 SODIMM1.109
AD5
  Top 0.203: U1.83 38.86,15.7 40.69,13.87 40.69,4.57 38.86,2.74 38.86,1.52 SODIMM1.111
AD6
  Top 0.203: U1.84 39.17,16 41.15,14.02 41.15,4.42 39.32,2.59 39.32,1.52 SODIMM1.113
AD7
  Top 0.203: U1.85 39.62,16.31 41.6,14.33 41.6,4.27 39.93,2.59 39.93,1.52 SODIMM1.115
AD8
  Top 0.203: U1.88 40.69,17.37 42.06,16 42.06,4.12 40.54,2.59 40.54,1.52 SODIMM1.117
AD9
  Top 0.203: U1.89 41,17.83 42.52,16.31 42.52,3.96 41.15,2.59 41.15,1.52 SODIMM1.119
AD10
  Top 0.203: U1.90 41.3,18.14 42.98,16.46 42.98,3.81 41.76,2.59 41.76,1.52 SODIMM1.121
AD11(TXD3)
  Top 0.203: U1.91 41.76,18.44 43.43,16.76 43.43,3.66 42.37,2.59 42.37,1.52 SODIMM1.123
AD14(RXD3)
  Top 0.203: U1.92 42.06,18.9 43.89,17.07 43.89,4.72 45.26,3.35 45.26,1.52 SODIMM1.133
AREF  (via drill 0.2)
  Top 0.203: v33.22,7.62 33.22,8.23 C34.2 | 33.98,5.18 34.44,4.72 34.44,4.42 L3.1 | 33.98,5.18 v33.68,5.49 | 33.98,5.18 33.98,1.52 SODIMM1.95
  Bottom 0.203: v33.22,7.62 33.22,5.94 v33.68,5.49
AVREF
  Top 0.203: L3.2 34.44,6.55 34.44,8.23 C19.2 34.59,8.38 36.42,10.21 36.42,12.34 35.97,12.8 U1.75
CANRX0  (via drill 0.2)
  Top 0.203: v25.45,30.02 25.45,30.48 24.23,31.7 U1.24 | v16,9.75 9.45,3.2 9.45,1.52 SODIMM1.25
  Bottom 0.203: v25.45,30.02 25.45,25.76 24.99,25.3 24.99,23.62 25.3,23.32 25.3,17.98 24.08,16.76 24.08,13.87 19.96,9.75 v16,9.75
CANTX0  (via drill 0.2)
  Top 0.203: v27.74,20.42 22.71,25.45 22.71,26.52 22.86,26.67 24.69,26.67 25.91,27.89 25.91,30.79 24.69,32 U1.23 | v18.75,11.43 15.7,8.38 15.39,8.38 10.06,3.05 10.06,1.52 SODIMM1.27
  Route15 0.203: v18.75,11.43 v27.74,20.42
CANTX1/IO  (via drill 0.2)
  Top 0.203: v36.12,36.27 36.12,37.95 36.58,38.41 U1.140 | v44.65,3.2 44.65,1.52 SODIMM1.131
  Route15 0.203: v44.65,3.2 v46.94,5.49
  Bottom 0.203: v36.12,36.27 36.12,35.36 37.8,33.68 37.8,14.63 v46.94,5.49
D+  (via drill 0.2)
  Top 0.203: v18.29,23.62 17.98,23.32 17.98,22.71 R6.1 | v19.36,24.69 19.96,24.69 U1.37 | v18.29,3.05 18.29,1.52 SODIMM1.43
  Route15 0.203: v19.36,24.69 v18.29,23.62
  Bottom 0.203: v18.29,3.05 18.29,6.71 13.26,11.73 13.26,22.25 13.41,22.4 17.07,22.4 v18.29,23.62
D-  (via drill 0.2)
  Top 0.203: U1.38 20.27,24.08 19.96,23.77 19.51,23.77 18.59,24.69 R5.1 18.44,24.69 v17.37,24.69 | v15.09,5.79 17.68,3.2 17.68,1.52 SODIMM1.41
  Bottom 0.203: v17.37,24.69 15.54,24.69 13.72,22.86 13.26,22.86 12.8,22.4 12.8,8.08 v15.09,5.79
DAC0(CANRX1)
  Top 0.203: U1.76 36.42,13.26 36.88,12.8 36.88,8.38 35.36,6.86 35.36,3.5 34.59,2.74 34.59,1.52 SODIMM1.97
DAC1
  Top 0.203: U1.77 36.73,13.56 37.34,12.95 37.34,5.49 35.81,3.96 35.81,3.35 35.2,2.74 35.2,1.52 SODIMM1.99
ERASE_CMD
  Top 0.203: T3.3 5.79,34.9 5.79,39.17 JP1.2
ERASE_S
  Top 0.203: T3.1 6.86,36.88 6.86,39.62 9.45,42.22 39.47,42.22 43.13,38.56 ERASE.2 43.13,38.41 43.13,37.95 40.23,35.05 U1.130
GND  (via drill 0.2)
  Top 0.203: C14.1 20.57,20.12 20.12,20.57 C9.1 19.96,20.73 19.66,20.73 19.05,21.34 16.46,21.34 15.24,22.55 C4.1 15.09,22.71 15.09,23.32 14.17,24.23 13.87,24.23 | 21.18,19.51 20.73,19.96 C14.1 | 21.18,19.51 21.95,18.75 R8.1 | 21.18,19.51 21.95,20.27 | 21.95,20.27 23.01,21.34 U1.46 | 21.95,20.27 21.95,21.64 22.4,22.1 U1.44 | C14.1 20.57,19.96 20.57,16.76 21.18,16.15 C24.2 21.34,16 21.34,13.72 C23.2 21.18,13.56 20.57,12.95 20.57,12.5 22.55,10.52 | 25.45,15.85 26.06,15.85 27.28,17.07 U1.58 | 25.45,15.85 24.84,15.85 C15.1 24.69,16 24.69,17.37 25.15,17.83 25.3,17.83 25.91,18.44 U1.54 | C3.- 22.86,10.97 24.54,12.65 C6.1 24.69,12.65 25.45,13.41 25.45,15.85 | v25.56,4.73 25.56,2.32 25.45,1.52 SODIMM1.67 | 22.55,10.52 22.86,10.82 C3.- | 22.55,10.52 C3.- | C5.1 26.67,38.41 27.28,39.01 C13.1 | U1.12 28.35,35.97 27.28,37.03 26.82,37.03 26.52,37.34 26.52,38.25 C5.1 | 20.73,40.08 19.96,40.08 19.2,39.32 JTAG.9 19.05,39.17 16.61,36.73 16.61,34.9 C33.- 16.61,34.75 16.61,32.92 17.37,32.16 | 20.73,40.08 21.49,39.32 JTAG.5 22.86,39.17 JTAG.3 | 20.73,40.08 24.84,40.08 26.52,38.41 C5.1 | 15.7,30.94 15.39,30.63 Y1.4 15.7,30.94 | 15.7,30.94 16.15,31.39 16.46,31.39 C21.2 16.61,31.55 17.22,32.16 17.37,32.16 | 17.37,32.16 18.44,32.16 C32.1 18.59,32 18.59,31.09 21.03,28.65 U1.33 | 15.7,30.94 15.7,27.74 Y1.2 15.7,27.58 14.02,27.58 13.87,27.43 C22.2 13.87,27.28 13.87,24.23 | C25.2 11.89,23.32 12.8,24.23 R7.1 | 13.87,24.23 12.95,24.23 R7.1 | R7.1 12.8,24.38 9.91,27.28 9.3,27.28 C2.- 9.14,27.43 3.2,33.38 3.2,39.17 JP1.1 | C16.1 49.07,18.75 50.29,19.96 C7.1 50.44,20.12 50.44,20.88 49.84,21.49 49.23,21.49 46.94,23.77 U1.106 46.79,23.93 v46.18,24.54
  Top 0.203: L.C 59.44,39.62 56.84,39.62 ON.C 56.69,39.62 54.86,39.62 54.56,39.93 51.51,39.93 50.14,38.56 RESET.2 49.99,38.41 49.99,36.42 48.46,34.9 46.18,34.9 | 44.81,34.9 43.59,36.12 C8.1 | 44.81,34.9 43.13,34.9 41.76,33.53 U1.126 | 44.81,34.9 C17.1 44.96,34.9 46.18,34.9 | 46.18,34.9 v46.18,30.33 | v1.52,1.52 2.13,1.52 SODIMM1.1 | SODIMM1.33 11.89,1.52 12.34,1.52 SODIMM1.35 12.5,1.52 12.8,1.52 SODIMM1.37 12.95,1.52 13.41,1.52 SODIMM1.39 13.56,1.52 v14.17,1.52 | SODIMM1.91 32.77,1.52 33.22,1.52 SODIMM1.93 33.38,1.52 v33.38,3.05 | 33.83,9.3 34.44,9.3 C19.1 | 33.83,9.3 33.38,9.3 | 33.38,9.3 33.22,9.3 C34.1 33.38,9.3 | 33.38,9.3 33.38,10.67 C10.1 33.38,10.82 33.38,11.58 34.9,13.11 35.05,13.11 | 35.05,13.11 35.51,12.65 U1.74 | SODIMM1.125 42.98,1.52 43.43,1.52 SODIMM1.127 43.59,1.52 44.04,1.52 | v44.04,3.05 44.04,1.52 | 44.04,1.52 SODIMM1.129 | v33.83,8.84 33.83,9.3 | v44.35,22.71 43.59,22.71 35.05,14.17 35.05,13.11 | 26.32,18.89 26.66,19.22 26.66,19.48 26.66,19.52 26.66,19.98 v26.49,20.15
  Bottom 0.203: v46.18,30.33 v46.18,24.54 v44.35,22.71 | SODIMM1.200 65.08,1.52 64.62,1.52 SODIMM1.198 64.47,1.52 64.01,1.52 SODIMM1.196 63.86,1.52 63.4,1.52 SODIMM1.194 63.25,1.52 62.79,1.52 SODIMM1.192 62.64,1.52 62.18,1.52 SODIMM1.190 62.03,1.52 61.57,1.52 SODIMM1.188 61.42,1.52 60.96,1.52 SODIMM1.186 60.81,1.52 60.35,1.52 SODIMM1.184 60.2,1.52 59.89,1.52 SODIMM1.182 59.74,1.52 59.28,1.52 SODIMM1.180 59.13,1.52 58.67,1.52 SODIMM1.178 58.52,1.52 58.06,1.52 SODIMM1.176 57.91,1.52 57.45,1.52 SODIMM1.174 57.3,1.52 56.84,1.52 SODIMM1.172 56.69,1.52 56.24,1.52 SODIMM1.170 56.08,1.52 55.63,1.52 SODIMM1.168 55.47,1.52 55.02,1.52 SODIMM1.166 54.86,1.52 54.41,1.52 SODIMM1.164 54.25,1.52 53.8,1.52 SODIMM1.162 53.65,1.52 53.19,1.52 SODIMM1.160 53.03,1.52 52.58,1.52 SODIMM1.158 52.43,1.52 51.97,1.52 SODIMM1.156 51.82,1.52 51.36,1.52 SODIMM1.154 51.21,1.52 50.9,1.52 SODIMM1.152 50.75,1.52 50.29,1.52 SODIMM1.150 50.14,1.52 49.68,1.52 SODIMM1.148 49.53,1.52 49.07,1.52 SODIMM1.146 48.92,1.52 48.46,1.52 SODIMM1.144 48.31,1.52 47.85,1.52 SODIMM1.142 47.7,1.52 47.24,1.52 SODIMM1.140 47.09,1.52 46.63,1.52 SODIMM1.138 46.48,1.52 46.02,1.52 SODIMM1.136 45.87,1.52 45.41,1.52 SODIMM1.134 45.26,1.52 44.81,1.52 SODIMM1.132 44.65,1.52 44.2,1.52 SODIMM1.129 44.04,1.52 | v1.52,1.52 2.13,1.52 SODIMM1.1 2.29,1.52 2.74,1.52 SODIMM1.4 2.9,1.52 3.2,1.52 SODIMM1.6 3.35,1.52 3.81,1.52 SODIMM1.8 3.96,1.52 4.42,1.52 SODIMM1.10 4.57,1.52 5.03,1.52 SODIMM1.12 5.18,1.52 5.64,1.52 SODIMM1.14 5.79,1.52 6.25,1.52 SODIMM1.16 6.4,1.52 6.86,1.52 SODIMM1.18 7.01,1.52 7.47,1.52 SODIMM1.20 7.62,1.52 8.08,1.52 SODIMM1.22 8.23,1.52 8.69,1.52 SODIMM1.24 8.84,1.52 9.3,1.52 SODIMM1.26 9.45,1.52 9.91,1.52 SODIMM1.28 10.06,1.52 10.52,1.52 SODIMM1.30 10.67,1.52 11.12,1.52 SODIMM1.32 11.28,1.52 11.73,1.52 SODIMM1.33 11.89,1.52 12.34,1.52 SODIMM1.35 12.5,1.52 12.8,1.52 SODIMM1.37
  Bottom 0.203: 13.11,1.52 12.95,1.52 SODIMM1.37 | 13.11,1.52 13.41,1.52 SODIMM1.39 13.56,1.52 v14.17,1.52 | 15.85,4.27 16.61,4.27 17.68,3.2 17.68,1.52 SODIMM1.42 17.83,1.52 18.29,1.52 SODIMM1.44 18.44,1.52 18.9,1.52 SODIMM1.46 19.05,1.52 19.51,1.52 SODIMM1.48 19.66,1.52 19.6,2.03 19.6,3.38 v20.96,4.73 v25.56,4.73 25.56,5.96 v24.97,6.55 | 13.11,1.52 SODIMM1.37 | 33.38,1.52 v33.38,3.05 | 33.38,1.52 33.83,1.52 SODIMM1.96 33.98,1.52 34.44,1.52 SODIMM1.98 34.59,1.52 35.05,1.52 SODIMM1.100 35.2,1.52 35.66,1.52 SODIMM1.102 35.81,1.52 | 33.38,1.52 SODIMM1.93 33.22,1.52 32.77,1.52 SODIMM1.91 32.61,1.52 32.16,1.52 SODIMM1.90 32,1.52 31.7,1.52 SODIMM1.88 31.55,1.52 31.09,1.52 SODIMM1.86 30.94,1.52 30.48,1.52 SODIMM1.84 30.33,1.52 29.87,1.52 SODIMM1.82 29.72,1.52 29.26,1.52 SODIMM1.80 29.11,1.52 28.65,1.52 SODIMM1.78 28.5,1.52 28.04,1.52 SODIMM1.76 27.89,1.52 27.43,1.52 SODIMM1.74 27.28,1.52 26.82,1.52 SODIMM1.72 26.67,1.52 26.21,1.52 SODIMM1.70 26.06,1.52 25.6,1.52 SODIMM1.67 | 44.04,1.52 43.59,1.52 SODIMM1.127 43.43,1.52 42.98,1.52 SODIMM1.125 42.82,1.52 42.37,1.52 SODIMM1.124 42.22,1.52 41.76,1.52 SODIMM1.122 41.6,1.52 41.3,1.52 SODIMM1.120 41.15,1.52 40.69,1.52 SODIMM1.118 40.54,1.52 40.08,1.52 SODIMM1.116 39.93,1.52 39.47,1.52 SODIMM1.114 39.32,1.52 38.86,1.52 SODIMM1.112 38.71,1.52 38.25,1.52 SODIMM1.110 38.1,1.52 37.64,1.52 SODIMM1.108 37.49,1.52 37.03,1.52 SODIMM1.106 | 44.04,1.52 v44.04,3.05 | v63.25,3.8 v63.25,4.69 | 65.06,1.52 v65.78,1.52 | 65.15,1.52 65.15,2.41 | 65.15,2.41 65.15,3.93 | 65.15,3.93 65.15,5.62 | 65.15,5.62 65.15,7.35 v65.78,7.99
  Bottom 0.203: v65.78,6.25 65.15,5.62 | v65.78,4.56 65.15,3.93 | v65.78,3.04 65.15,2.41 | v12.42,3.04 12.42,6.55 v12.21,6.76
  other vias: 59.74,5.92 59.74,5.03 56.7,5.15 56.7,4.27 39.72,7.1 39.72,6.21 39.72,5.32 44.02,3.76 1.52,4.95 2.16,4.02 6.09,6.09 5.75,4.82 5.75,3.59 8.54,6.3 7.9,5.66 7.27,5.03 14.45,4.27 12.97,3.34 12.21,7.65 16.14,6.42 16.86,5.7 17.53,5.03 20.91,6.72 20.91,5.7 30.46,5.66 30.93,5.2 30.93,4.52 36.72,7.31 35.95,6.51 36.34,5.28 20.58,19.01 21.21,11.87 42.84,34.6 28.43,17.79 20.2,29.49 13.86,26.62
  pour Route2 (isolate 0.254): -1.35,43.6 73.68,43.6 73.68,0 -1.35,0
JTAG_TCK  (via drill 0.2)
  Top 0.203: RN1.2 22.1,35.2 v22.1,35.97 22.1,37.03 22.86,37.8 JTAG.4 | v22.1,32.31 22.1,30.94 22.71,30.33 U1.28
  Bottom 0.203: v22.1,35.97 v22.1,32.31
JTAG_TDI  (via drill 0.2)
  Top 0.203: RN1.3 21.18,35.2 21.18,37.03 20.42,37.8 JTAG.8 | v19.51,33.68 19.51,32.92 22.4,30.02 U1.29
  Bottom 0.203: v19.51,33.68 19.51,37.03 20.27,37.8 JTAG.8
JTAG_TDO  (via drill 0.2)
  Top 0.203: v24.54,28.8 22.86,28.8 22.1,29.57 U1.30
  Bottom 0.203: v24.54,28.8 24.54,34.29 21.64,37.19 21.64,37.8 JTAG.6
JTAG_TMS  (via drill 0.2)
  Top 0.203: JTAG.2 24.08,37.8 22.86,36.58 22.86,35.2 RN1.1 22.86,35.05 v23.93,33.98 | v24.08,28.35 22.55,28.35 21.79,29.11 U1.31
  Bottom 0.203: v24.08,28.35 24.08,33.83 v23.93,33.98
MASTER-RESET  (via drill 0.2)
  Top 0.203: v22.4,19.96 23.47,21.03 U1.47 23.62,21.18 24.38,21.95 v24.38,22.25 | v20.12,17.68 20.12,5.9 19.6,5.41 19.6,1.35 SODIMM1.47 | JTAG.10 19.2,37.8 20.42,36.58 20.42,35.2 RN1.4 20.57,35.05 v19.96,34.44 | 49.23,39.62 49.23,36.58 C20.1 | 49.23,39.62 50.14,40.54 65.53,40.54 65.84,40.23 65.84,38.86 65.53,38.56 54.1,38.56 RESET.1 | v40.84,41.6 47.24,41.6 49.23,39.62
  Bottom 0.203: v20.12,17.68 v22.4,19.96 | 16.31,38.71 15.85,39.17 JP1.6 16.31,38.71 | 16.31,38.71 17.07,37.95 19.05,37.95 JTAG.10 | 16.31,38.71 17.53,39.93 17.53,40.69 18.44,41.6 v40.84,41.6 | v24.38,22.25 24.38,23.01 23.62,23.77 23.62,30.02 19.96,33.68 v19.96,34.44
MISO  (via drill 0.2)
  Top 0.203: v48.62,23.01 48.62,23.77 48.46,23.93 48.31,23.93 47.7,24.54 U1.108 | v49.68,7.16 49.68,4.57 50.29,3.96 50.29,3.05 50.75,2.59 50.75,1.52 SODIMM1.151
  Bottom 0.203: v48.62,23.01 48.62,11.43 49.68,10.36 v49.68,7.16
MOSI  (via drill 0.2)
  Top 0.203: v48.62,26.82 48.01,27.43 47.7,27.43 U1.109 | v50.14,6.55 50.14,4.72 50.75,4.12 50.75,3.2 51.36,2.59 51.36,1.52 SODIMM1.153
  Bottom 0.203: v48.62,26.82 48.62,23.77 50.14,22.25 v50.14,6.55
N$2
  Top 0.203: RN3.3 60.35,29.87 60.35,36.58 59.59,37.34 L.A
N$3
  Top 0.203: RN3.4 59.59,29.87 59.59,34.59 56.84,37.34 ON.A
N$4
  Bottom 0.203: 59.74,1.56 59.74,5.92
N$5
  Top 0.203: R8.2 22.71,19.2 23.16,19.2 23.32,19.05 24.38,19.05 24.84,19.51 U1.51
N$7
  Top 0.203: R4.1 22.86,17.68 24.38,17.68 25.6,18.9 U1.53
N$8
  Bottom 0.203: 57.38,1.56 57.38,3.04 56.7,3.72 56.7,5.15
N$9
  Bottom 0.203: 63.33,1.52 63.33,3.72 63.25,3.8
N$10
  Bottom 0.203: 35.41,1.52 36.34,1.52 | 36.34,1.52 36.97,1.52 | 36.97,1.52 37.39,1.52 | 36.97,1.52 36.97,5.45 35.91,6.51 | 36.34,1.52 36.34,5.28
N$11
  Top 0.203: R5.2 17.98,25.45 21.64,25.45 23.16,23.93 23.16,23.32 22.86,23.01 22.55,23.01 22.1,22.55 U1.43
N$12  (via drill 0.2)
  Top 0.203: v19.36,22.71 19.2,22.71 18.59,22.1 R6.2 | v22.71,23.62 22.55,23.62 21.79,22.86 U1.42
  Route15 0.203: v19.36,22.71 20.12,22.71 21.79,24.38 22.4,24.38 22.71,24.08 v22.71,23.62
N$13
  Bottom 0.203: 39.42,1.52 39.42,4.73 39.72,5.03 40.01,4.73 40.01,2.24
N$14
  Bottom 0.203: 39.72,4.99 39.72,7.1
N$15
  Bottom 0.203: 43.56,1.56 43.56,3.3 44.02,3.76
N$16
  Bottom 0.203: 1.52,4.94 1.52,3.59 2.15,2.96 | 2.15,2.96 2.15,1.82 | 2.15,2.96 2.15,4.01
N$17
  Bottom 0.203: 2.49,1.52 1.52,1.52
N$18
  Top 0.203: 2.15,4.01 2.15,2.96 | 2.15,2.96 2.15,2.07 | 1.52,4.94 1.52,3.59 2.15,2.96
N$19
  Bottom 0.203: 5.75,1.52 5.75,5.75 6.08,6.08
N$20
  Bottom 0.203: 7.01,2.24 7.01,2.75 7.27,3 7.27,5.03 8.53,6.29
N$21
  Bottom 0.203: 15.84,4.27 14.45,4.27 13.56,3.38 13.56,1.73
N$22
  Top 0.203: 17.66,3.21 16.6,4.27
N$23
  Bottom 0.203: 12.97,1.48 12.97,3.3 12.97,3.34 12.97,6.89 12.21,7.65
N$24
  Bottom 0.203: 12.34,1.56 12.34,2.96 12.42,3.04
N$25
  Top 0.203: 12.34,1.73 12.34,2.96 12.42,3.04
N$26
  Top 0.203: 12.97,1.6 12.97,3.34
N$27
  Top 0.203: 13.56,2.24 13.56,3.38 14.45,4.27
N$28
  Bottom 0.203: 17.75,1.52 17.75,4.82 16.14,6.42
N$29
  Bottom 0.203: 18.97,1.48 18.97,3.76 20.91,5.7 20.91,6.72
N$31
  Bottom 0.203: 35.74,1.48 35.74,6.34 36.72,7.31
N$32
  Bottom 0.203: 32.15,1.56 32.15,2.92 31.56,3.51 | 31.56,1.52 31.56,3.51 | 31.56,3.51 31.56,3.89 30.93,4.52 30.93,5.2 30.46,5.66
N$33
  Top 0.203: 27.76,17.49 28.05,17.79 28.43,17.79
N$54
  Top 0.203: RN3.1 62.18,29.87 62.18,34.75 64.77,37.34 RX.A
N$55
  Top 0.203: RN3.2 61.27,29.87 61.27,36.42 62.18,37.34 TX.A
PIN22  (via drill 0.2)
  Top 0.203: v31.55,40.69 32.31,39.93 U1.1 | v17.07,40.39 v17.98,40.39 | v2.74,23.77 2.74,1.52 SODIMM1.3
  Bottom 0.203: v31.55,40.69 25.45,40.69 24.99,41.15 18.75,41.15 v17.98,40.39 | v17.07,40.39 12.8,40.39 11.89,39.47 11.89,37.95 2.74,28.8 v2.74,23.77
PIN23  (via drill 0.2)
  Top 0.203: v29.41,38.56 30.18,37.8 U1.7 | v24.69,40.69 18.44,40.69 18.29,40.84 15.7,40.84 14.48,39.62 v14.48,36.73 | v4.42,26.67 4.42,7.32 3.35,6.25 3.35,1.52 SODIMM1.5
  Bottom 0.203: v29.41,38.56 26.82,38.56 v24.69,40.69 | v4.42,26.67 v14.48,36.73
PIN24  (via drill 0.2)
  Top 0.203: v11.89,33.22 11.89,39.47 13.72,41.3 25.91,41.3 29.11,38.1 29.26,38.1 29.87,37.49 U1.8 | v3.96,5.94 3.96,1.52 SODIMM1.7
  Bottom 0.203: v11.89,33.22 11.89,32.77 3.96,24.84 v3.96,5.94
PIN25  (via drill 0.2)
  Top 0.203: v28.65,34.29 28.65,35.05 28.19,35.51 U1.13 | v19.2,20.42 18.75,20.42 4.57,6.25 4.57,1.52 SODIMM1.9
  Bottom 0.203: v28.65,34.29 24.99,30.63 24.99,25.91 24.54,25.45 24.54,23.47 24.84,23.16 24.84,21.95 23.32,20.42 v19.2,20.42
PIN26  (via drill 0.2)
  Top 0.203: v28.19,32.92 28.19,34.9 27.89,35.2 U1.14 | v18.29,19.2 5.18,6.1 5.18,1.52 SODIMM1.11
  Route15 0.203: v28.19,32.92 25.76,30.48 25.15,30.48 19.81,25.15 19.81,24.08 18.29,22.55 v18.29,19.2
PIN27  (via drill 0.2)
  Top 0.203: v23.32,36.27 26.06,36.27 27.28,35.05 U1.15 | v8.99,8.08 6.25,5.33 6.25,3.2 5.79,2.74 5.79,1.52 SODIMM1.13
  Route15 0.203: v19.36,32.31 v23.32,36.27
  Bottom 0.203: v19.36,32.31 17.22,32.31 16.76,32.77 13.11,32.77 8.99,28.65 v8.99,8.08
PIN28  (via drill 0.2)
  Top 0.203: v26.06,35.51 26.98,34.59 U1.16 | v19.2,40.08 18.9,40.08 v15.24,36.42 | v6.71,3.81 6.71,3.05 6.4,2.74 6.4,1.52 SODIMM1.15
  Bottom 0.203: v26.06,35.51 26.06,38.71 24.69,40.08 v19.2,40.08 | v15.24,36.42 15.24,35.51 6.71,26.98 v6.71,3.81
PIN29  (via drill 0.2)
  Top 0.203: v22.55,31.85 24.69,33.98 25.45,33.98 25.91,33.53 U1.19 | v9.75,6.25 7.16,3.66 7.16,2.9 7.01,2.74 7.01,1.52 SODIMM1.17
  Route15 0.203: v21.03,30.33 v22.55,31.85
  Bottom 0.203: v21.03,30.33 18.59,30.33 18.44,30.18 13.87,30.18 13.56,30.48 11.43,30.48 9.75,28.8 v9.75,6.25
PIN30  (via drill 0.2)
  Top 0.203: v23.16,26.21 24.84,26.21 26.36,27.74 26.36,30.94 24.99,32.31 U1.22 | v7.77,3.2 7.77,2.9 7.62,2.74 7.62,1.52 SODIMM1.19
  Bottom 0.203: v23.16,26.21 17.22,26.21 13.41,30.02 11.58,30.02 10.21,28.65 10.21,5.64 v7.77,3.2
PIN31  (via drill 0.2)
  Top 0.203: v22.71,27.13 24.54,27.13 25.45,28.04 25.45,29.11 23.62,30.94 U1.26 | v19.51,27.13 16.61,27.13 v15.54,26.06 | v11.43,11.58 11.43,6.4 8.23,3.2 8.23,1.52 SODIMM1.21
  Bottom 0.203: v19.51,27.13 v22.71,27.13 | v15.54,26.06 15.24,26.06 11.43,22.25 v11.43,11.58
PIN32  (via drill 0.2)
  Top 0.203: v14.33,25.91 14.63,25.6 15.85,25.6 16.31,26.06 19.81,26.06 21.95,28.19 21.95,28.35 21.49,28.8 U1.32 | v8.99,3.2 8.99,2.9 8.84,2.74 8.84,1.52 SODIMM1.23
  Bottom 0.203: v14.33,25.91 10.67,22.25 10.67,4.88 v8.99,3.2
PIN33  (via drill 0.2)
  Top 0.203: v25.45,17.37 26.21,18.14 U1.55 | 26.06,1.52 SODIMM1.69 26.11,1.44 v26.11,4.01
  Bottom 0.203: v25.45,17.37 25.45,10.46 26.11,9.8 v26.11,4.01
PIN34  (via drill 0.2)
  Top 0.203: v26.98,16 27.74,16.76 U1.59 | v26.82,3.35 26.82,1.52 SODIMM1.71
  Bottom 0.203: v26.98,16 26.98,3.5 v26.82,3.35
PIN35
  Top 0.203: U1.60 28.04,16.31 26.36,14.63 26.36,11.89 23.62,9.14 21.79,9.14 21.49,8.84 21.49,7.01 22.73,5.77 25.84,5.77 27.28,4.33 27.28,1.52 SODIMM1.73
PIN36  (via drill 0.2)
  Top 0.203: v32.61,17.37 45.11,29.87 U1.116 | v29.26,4.72 28.04,3.5 28.04,1.52 SODIMM1.75
  Bottom 0.203: v32.61,17.37 32.61,13.41 29.26,10.06 v29.26,4.72
PIN37  (via drill 0.2)
  Top 0.203: v27.89,14.02 29.11,15.24 U1.63 | v28.5,3.2 28.5,1.52 SODIMM1.77
  Bottom 0.203: v27.89,14.02 27.43,13.56 27.43,4.27 v28.5,3.2
PIN38  (via drill 0.2)
  Top 0.203: v28.35,12.95 28.35,13.87 29.41,14.94 U1.64 | v28.35,7.47 28.35,6.4 29.72,5.03 29.72,4.27 29.26,3.81 29.26,1.52 SODIMM1.79
  Bottom 0.203: v28.35,7.47 v28.35,12.95
PIN39  (via drill 0.2)
  Top 0.203: v29.11,13.87 29.87,14.63 U1.65 | v29.72,3.05 29.72,1.52 SODIMM1.81
  Bottom 0.203: v29.11,13.87 28.5,13.87 27.89,13.26 27.89,4.72 29.57,3.05 v29.72,3.05
PIN40  (via drill 0.2)
  Top 0.203: v28.8,10.06 28.8,12.8 30.18,14.17 U1.66 | v29.87,3.66 30.33,3.2 30.33,1.52 SODIMM1.83
  Bottom 0.203: v28.8,10.06 28.8,4.42 29.57,3.66 v29.87,3.66
PIN41  (via drill 0.2)
  Top 0.203: v29.87,9.91 29.87,13.26 30.48,13.87 U1.67 | v30.94,3.5 30.94,1.52 SODIMM1.85
  Bottom 0.203: v29.87,9.91 29.87,4.57 v30.94,3.5
PIN42  (via drill 0.2)
  Top 0.203: v31.55,11.58 31.55,12.19 31.85,12.5 U1.71 | v31.55,6.1 31.55,1.52 SODIMM1.87
  Bottom 0.203: v31.55,6.1 v31.55,11.58
PIN43  (via drill 0.2)
  Top 0.203: v32.46,7.47 32.46,12.19 U1.72 | v32.46,3.35 32.46,2.9 32.16,2.59 32.16,1.52 SODIMM1.89
  Bottom 0.203: v32.46,3.35 v32.46,7.47
PIN44  (via drill 0.2)
  Top 0.203: v49.07,10.21 49.07,16.31 46.79,18.59 46.79,20.57 45.26,22.1 U1.101 | v49.07,7.62 49.07,4.57 49.84,3.81 49.84,2.9 50.14,2.59 50.14,1.52 SODIMM1.149
  Bottom 0.203: v49.07,7.62 v49.07,10.21
PIN45  (via drill 0.2)
  Top 0.203: v48.62,10.67 48.62,16 46.33,18.29 46.33,20.12 44.81,21.64 U1.100 | v48.62,8.23 48.62,4.42 49.38,3.66 49.38,2.74 49.53,2.59 49.53,1.52 SODIMM1.147
  Bottom 0.203: v48.62,8.23 v48.62,10.67
PIN46  (via drill 0.2)
  Top 0.203: v47.85,3.5 47.85,3.81 46.18,5.49 46.18,17.83 45.87,18.14 45.87,19.96 44.5,21.34 U1.99 | v48.77,3.5 48.77,2.74 48.92,2.59 48.92,1.52 SODIMM1.145
  Bottom 0.203: v48.77,3.5 v47.85,3.5
PIN47  (via drill 0.2)
  Top 0.203: v44.81,20.27 44.81,20.42 44.2,21.03 U1.98 | v48.16,8.69 48.16,4.12 48.31,3.96 48.31,1.52 SODIMM1.143
  Bottom 0.203: v44.81,20.27 44.81,18.14 48.16,14.78 v48.16,8.69
PIN48
  Top 0.203: U1.97 43.74,20.57 45.41,18.9 45.41,17.98 45.72,17.68 45.72,5.33 47.4,3.66 47.4,3.05 47.7,2.74 47.7,1.52 SODIMM1.141
PIN49
  Top 0.203: U1.96 43.43,20.27 44.96,18.75 44.96,17.83 45.26,17.53 45.26,5.18 46.94,3.5 46.94,2.9 47.09,2.74 47.09,1.52 SODIMM1.139
PIN50
  Top 0.203: U1.95 43.13,19.96 44.5,18.59 44.5,17.68 44.81,17.37 44.81,5.03 46.48,3.35 46.48,1.52 SODIMM1.137
PIN51
  Top 0.203: U1.94 42.82,19.51 44.04,18.29 44.04,17.53 44.35,17.22 44.35,4.88 45.87,3.35 45.87,1.52 SODIMM1.135
PWM2  (via drill 0.2)
  Top 0.203: v35.97,40.54 35.36,39.93 U1.144 | v64.16,5.64 64.16,2.9 64.01,2.74 64.01,1.52 SODIMM1.195
  Bottom 0.203: v35.97,40.54 59.59,40.54 59.89,40.84 63.7,40.84 64.16,40.39 v64.16,5.64
PWM3  (via drill 0.2)
  Top 0.203: v37.8,38.86 37.03,38.1 U1.139 | v63.7,6.1 63.7,3.05 63.4,2.74 63.4,1.52 SODIMM1.193
  Bottom 0.203: v37.8,38.86 58.52,38.86 60.05,40.39 63.55,40.39 63.7,40.23 v63.7,6.1
PWM5  (via drill 0.2)
  Top 0.203: v38.86,37.8 38.1,37.03 U1.136 | v62.79,16.46 v46.63,32.61 | v62.33,3.2 62.33,2.74 62.18,2.59 62.18,1.52 SODIMM1.189
  Bottom 0.203: v38.86,37.8 40.39,36.27 40.39,36.12 43.89,32.61 v46.63,32.61 | v62.79,16.46 62.79,3.66 v62.33,3.2
PWM6  (via drill 0.2)
  Top 0.203: v40.54,37.95 39.78,37.95 38.56,36.73 U1.135 | v55.63,27.58 v51.05,32.16 | v62.18,3.81 61.57,3.2 61.57,1.52 SODIMM1.187
  Bottom 0.203: v40.54,37.95 45.26,37.95 v51.05,32.16 | v55.63,27.58 62.33,20.88 62.33,3.96 v62.18,3.81
PWM7  (via drill 0.2)
  Top 0.203: v41.3,36.88 39.32,36.88 38.86,36.42 U1.134 | v51.51,29.41 v46.63,34.29 | v61.11,3.2 61.11,2.74 60.96,2.59 60.96,1.52 SODIMM1.185
  Bottom 0.203: v41.3,36.88 42.52,36.88 42.98,37.34 43.59,37.34 v46.63,34.29 | v51.51,29.41 61.42,19.51 61.42,3.5 v61.11,3.2
PWM8  (via drill 0.2)
  Top 0.203: v38.56,34.59 38.56,35.36 39.01,35.81 U1.133 | v60.2,3.35 60.2,2.74 60.35,2.59 60.35,1.52 SODIMM1.183
  Route15 0.203: v60.2,3.35 v56.54,7.01
  Bottom 0.203: v38.56,34.59 38.56,33.22 39.32,32.46 39.32,23.01 47.7,14.63 47.7,7.62 50.29,5.03 54.56,5.03 v56.54,7.01
PWM9  (via drill 0.2)
  Top 0.203: v40.84,36.42 40.39,36.42 39.62,35.66 U1.132 | v50.9,29.11 v46.63,33.38 | v60.5,5.49 60.5,4.42 59.74,3.66 59.74,1.52 SODIMM1.181
  Bottom 0.203: v40.84,36.42 43.59,36.42 v46.63,33.38 | v50.9,29.11 50.9,26.98 60.5,17.37 v60.5,5.49
PWM11  (via drill 0.2)
  Top 0.203: v38.86,30.63 28.19,30.63 25.76,33.07 U1.20 | v49.53,24.99 49.53,24.08 58.52,15.09 58.52,1.52 SODIMM1.177
  Route15 0.203: v38.86,30.63 43.89,30.63 v49.53,24.99
PWM12  (via drill 0.2)
  Top 0.203: v38.86,28.96 29.11,28.96 25.3,32.77 U1.21 | v52.88,14.94 52.88,14.48 57.91,9.45 57.91,1.52 SODIMM1.175
  Route15 0.203: v52.88,14.94 v38.86,28.96
PWM13  (via drill 0.2)
  Top 0.203: RN3.6 60.5,28.35 60.5,24.23 63.25,21.49 63.25,16.15 63.09,16 58.37,16 v56.69,17.68 49.99,24.38 49.99,25.3 49.38,25.91 43.13,25.91 30.94,13.72 U1.68 | v56.69,7.77 57.3,7.16 57.3,1.52 SODIMM1.173
  Bottom 0.203: v56.69,17.68 v56.69,7.77
RX  (via drill 0.2)
  Top 0.203: v23.16,29.26 23.62,29.72 23.62,30.18 23.16,30.63 U1.27 | v59.59,7.16 63.4,7.16 65.08,5.49 65.08,1.52 SODIMM1.199
  Route15 0.203: v23.16,27.58 v25.91,24.84
  Bottom 0.203: JP1.5 13.26,39.17 v23.16,29.26 v23.16,27.58 | v59.59,7.16 57.45,7.16 53.8,3.5 49.53,3.5 49.07,3.96 46.79,3.96 v25.91,24.84
RXD1  (via drill 0.2)
  Top 0.203: v36.73,33.98 31.7,39.01 U1.3 | v53.49,3.96 53.49,2.9 53.65,2.74 53.65,1.52 SODIMM1.161
  Bottom 0.203: v36.73,33.98 36.73,14.94 47.24,4.42 49.68,4.42 50.14,3.96 v53.49,3.96
RXD2  (via drill 0.2)
  Top 0.203: v31.7,37.64 30.94,38.41 U1.5 | v46.63,31.24 52.43,25.45 v52.43,22.71 | v52.43,12.95 52.43,6.4 54.86,3.96 54.86,1.52 SODIMM1.165
  Bottom 0.203: v31.7,37.64 38.1,37.64 44.5,31.24 v46.63,31.24 | v52.43,12.95 v52.43,22.71
RXD3  (via drill 0.2)
  Top 0.203: v40.23,31.09 29.11,31.09 26.36,33.83 U1.18 | v45.57,24.99 46.79,24.99 47.24,25.45 47.55,25.45 52.43,20.57 52.43,14.33 56.08,10.67 56.08,1.52 SODIMM1.169
  Bottom 0.203: v40.23,31.09 40.23,28.96 44.2,24.99 v45.57,24.99
RXL  (via drill 0.2)
  Top 0.203: v46.63,21.95 45.87,22.71 U1.103 | v63.25,39.93 64.47,39.93 64.77,39.62 RX.C
  Bottom 0.203: v46.63,21.95 46.63,26.36 60.2,39.93 v63.25,39.93
SCL0-3  (via drill 0.2)
  Top 0.203: v41.45,15.24 41.45,15.85 40.23,17.07 U1.87 | v51.66,4.42 51.66,3.5 52.58,2.59 52.58,1.52 SODIMM1.157
  Bottom 0.203: v41.45,15.24 41.45,13.26 50.29,4.42 v51.66,4.42
SCL1  (via drill 0.2)
  Top 0.203: v24.54,9.3 30.02,9.3 30.33,9.6 30.33,11.58 31.55,12.8 U1.70 | v18.75,9.3 17.83,9.3 11.12,2.59 11.12,1.52 SODIMM1.31
  Bottom 0.203: v18.75,9.3 v24.54,9.3
SDA0-3  (via drill 0.2)
  Top 0.203: v39.17,17.53 39.78,16.92 U1.86 | v46.63,12.5 46.63,10.97 53.03,4.57 53.03,1.52 SODIMM1.159
  Bottom 0.203: v39.17,17.53 41.6,17.53 v46.63,12.5
SDA1  (via drill 0.2)
  Top 0.203: v30.33,36.27 30.18,36.27 29.57,36.88 U1.9 | v18.75,10.67 17.83,9.75 17.68,9.75 10.67,2.74 10.67,1.52 SODIMM1.29
  Route15 0.203: v25.91,14.78 21.79,10.67 v18.75,10.67
  Bottom 0.203: v30.33,36.27 30.33,30.02 25.45,25.15 25.45,23.77 25.91,23.32 v25.91,14.78
SPCK  (via drill 0.2)
  Top 0.203: v49.07,27.28 48.01,28.35 47.85,28.35 47.4,27.89 U1.110 | v50.6,5.49 50.6,4.88 51.21,4.27 51.21,3.35 51.97,2.59 51.97,1.52 SODIMM1.155
  Bottom 0.203: v49.07,27.28 49.07,23.93 50.6,22.4 v50.6,5.49
SS0/PWM10  (via drill 0.2)
  Top 0.203: v44.5,25.45 44.5,23.47 45.41,22.55 U1.102 | 45.11,26.36 v44.5,26.36 | 45.11,26.36 46.79,28.04 U1.111 | v59.13,7.62 59.13,1.52 SODIMM1.179 | v51.97,23.93 49.53,26.36 45.11,26.36
  Bottom 0.203: v44.5,26.36 v44.5,25.45 | v59.13,7.62 59.13,16.76 v51.97,23.93
SS1/PWM4  (via drill 0.2)
  Top 0.203: v37.19,36.42 37.19,36.88 37.64,37.34 U1.137 | v45.57,28.04 46.02,28.04 46.48,28.5 U1.112 46.63,28.65 47.09,29.11 48.01,29.11 v51.51,25.6 | v60.05,6.71 62.79,3.96 62.79,1.52 SODIMM1.191
  Bottom 0.203: v37.19,36.42 37.8,36.42 45.57,28.65 v45.57,28.04 | v60.05,6.71 60.05,17.07 v51.51,25.6
TX  (via drill 0.2)
  Top 0.203: U1.2 31.85,39.62 29.72,41.76 13.26,41.76 10.82,39.32 JP1.4 | v64.62,3.05 64.62,1.52 SODIMM1.197
  Bottom 0.203: v64.62,3.05 64.62,40.54 63.09,42.06 13.56,42.06 10.82,39.32 JP1.4
TXD1  (via drill 0.2)
  Top 0.203: v38.25,32.77 37.19,32.77 36.27,33.68 36.27,33.83 31.39,38.71 U1.4 | v47.09,11.28 51.97,6.4 51.97,6.25 54.25,3.96 54.25,1.52 SODIMM1.163
  Bottom 0.203: v38.25,32.77 38.25,17.68 40.23,15.7 42.67,15.7 v47.09,11.28
TXD2  (via drill 0.2)
  Top 0.203: v39.78,32.31 36.27,32.31 30.63,37.95 U1.6 | v47.24,19.05 51.97,14.33 51.97,14.17 55.47,10.67 55.47,1.52 SODIMM1.167
  Bottom 0.203: v39.78,32.31 39.78,26.52 v47.24,19.05
TXD3  (via drill 0.2)
  Top 0.203: v25.91,34.9 26.06,34.9 26.67,34.29 U1.17 | v34.75,15.24 v34.75,16.76 | v56.54,3.05 56.84,2.74 56.84,1.52 SODIMM1.171
  Bottom 0.203: v25.91,34.9 28.19,34.9 30.02,36.73 30.63,36.73 34.75,32.61 v34.75,16.76 | v34.75,15.24 46.94,3.05 v56.54,3.05
TXL  (via drill 0.2)
  Top 0.203: v48.01,23.47 47.4,24.08 U1.107 | v60.5,39.47 62.18,39.47 TX.C
  Bottom 0.203: v48.01,23.47 48.01,26.98 v60.5,39.47
VBG  (via drill 0.2)
  Top 0.203: 13.72,22.71 12.5,22.71 C25.1 | 13.72,22.71 14.02,23.01 R7.2 13.72,22.71 | v19.36,22.1 19.66,22.1 21.03,23.47 U1.40 | 13.72,22.71 v13.72,21.95
  Bottom 0.203: v19.36,22.1 17.37,22.1 17.22,21.95 v13.72,21.95
VDDANA  (via drill 0.2)
  Top 0.203: U1.73 35.2,12.19 34.29,11.28 34.29,10.82 C10.2 34.14,10.67 v34.14,10.06 | 32,6.55 30.02,6.55 28.65,7.92 23.01,7.92 C3.+ | 32,6.55 33.07,6.55 L1.2 | 32,6.55 v32,7.92
  Bottom 0.203: v32,7.92 v34.14,10.06
VDDOUT  (via drill 0.2)
  Top 0.203: C15.2 25.45,16.61 26.67,17.83 U1.56 26.82,17.98 27.58,18.75 | 28.96,17.98 28.96,16.61 28.5,16.15 U1.61 | 28.96,17.98 28.19,18.75 27.58,18.75 | v21.49,21.34 21.34,21.18 21.34,20.73 C14.2 | U1.45 22.86,21.79 23.47,22.4 v23.47,22.55 23.62,22.71 24.69,22.71 27.58,19.81 27.58,18.75 | v11.89,29.57 10.82,29.57 L5.1 | C16.2 48.31,19.36 48.31,21.03 46.33,23.01 U1.104 46.18,23.16 v45.11,24.23 | C13.2 27.89,38.25 27.89,37.95 29.11,36.73 U1.10 29.26,36.58 33.98,31.85 40.69,31.85 | C17.2 44.2,34.14 43.59,34.14 42.37,32.92 U1.124 42.37,32.77 41.45,31.85 40.69,31.85 | 40.69,31.85 40.69,29.72 | 40.69,29.72 v40.69,26.36 | 40.69,29.72 28.96,17.98
  Bottom 0.203: v23.47,22.55 22.25,21.34 v21.49,21.34 13.26,29.57 v11.89,29.57 | v45.11,24.23 42.82,24.23 v40.69,26.36
VDDOUTMI  (via drill 0.2)
  Top 0.203: U1.41 21.34,23.01 20.73,22.4 20.73,21.34 C9.2 20.57,21.34 19.96,21.34 v19.81,21.49 | 9.14,24.99 7.47,24.99 7.16,25.3 C2.+ | 9.14,24.99 10.67,24.99 L2.2 | v13.72,21.03 13.11,21.03 9.14,24.99
  Bottom 0.203: v19.81,21.49 14.94,21.49 14.48,21.03 v13.72,21.03
VDDPLL  (via drill 0.2)
  Top 0.203: C32.2 17.98,31.39 17.98,30.79 v18.14,30.63 20.57,28.19 U1.34 | 14.17,32.31 14.48,32.61 C33.+ 14.17,32.31 | 14.17,32.31 13.11,31.24 12.34,31.24 L5.2 | 14.17,32.31 v16.46,32.31
  Bottom 0.203: v16.46,32.31 v18.14,30.63
XIN  (via drill 0.2)
  Top 0.203: 13.26,28.04 13.26,28.35 14.02,29.11 Y1.1 | v19.05,27.58 19.96,27.58 U1.36 | 13.26,28.04 v14.94,29.72 | 13.26,28.04 C22.1
  Bottom 0.203: v19.05,27.58 17.07,27.58 v14.94,29.72
XIN32  (via drill 0.2)
  Top 0.203: Y2.P$2 22.86,16.46 22.4,16.92 21.34,16.92 C24.1 21.34,17.07 v21.34,18.14 | v23.16,19.96 23.77,20.57 U1.48
  Bottom 0.203: v21.34,18.14 v23.16,19.96
XOUT
  Top 0.203: C21.1 17.07,30.63 17.07,28.96 Y1.3 17.07,28.8 19.36,28.8 20.27,27.89 U1.35
XOUT32  (via drill 0.2)
  Top 0.203: 21.95,12.8 22.4,12.8 22.86,13.26 Y2.P$1 | 21.95,12.8 21.34,12.8 C23.1 | v23.62,19.51 23.62,19.81 24.08,20.27 U1.49 | v21.79,15.54 21.79,14.02 21.95,13.87 21.95,12.8
  Bottom 0.203: v23.62,19.51 23.62,17.68 21.79,15.85 v21.79,15.54
XUSB  (via drill 0.2)
  Top 0.203: v21.34,24.69 21.34,24.54 20.73,23.93 U1.39 | v17.83,17.53 17.83,13.11 19.2,11.73 19.2,2.9 19.05,2.74 19.05,1.52 SODIMM1.45
  Bottom 0.203: v21.34,24.69 21.34,24.23 22.55,23.01 23.77,23.01 23.93,22.86 23.93,22.25 22.55,20.88 18.44,20.88 17.83,20.27 v17.83,17.53